# EasyEDA Pro project ProPrj_STM32H723.epro, schematic Schematic1

## Sheets
1 P1: Create Date: 2024-04-22; Page Name: P1; Project Name: STM32H723; Schematic Name: Schematic1; Update Date: 2024-05-16; Company: 嘉立创EDA; Page Size: A4; Version: V1.0
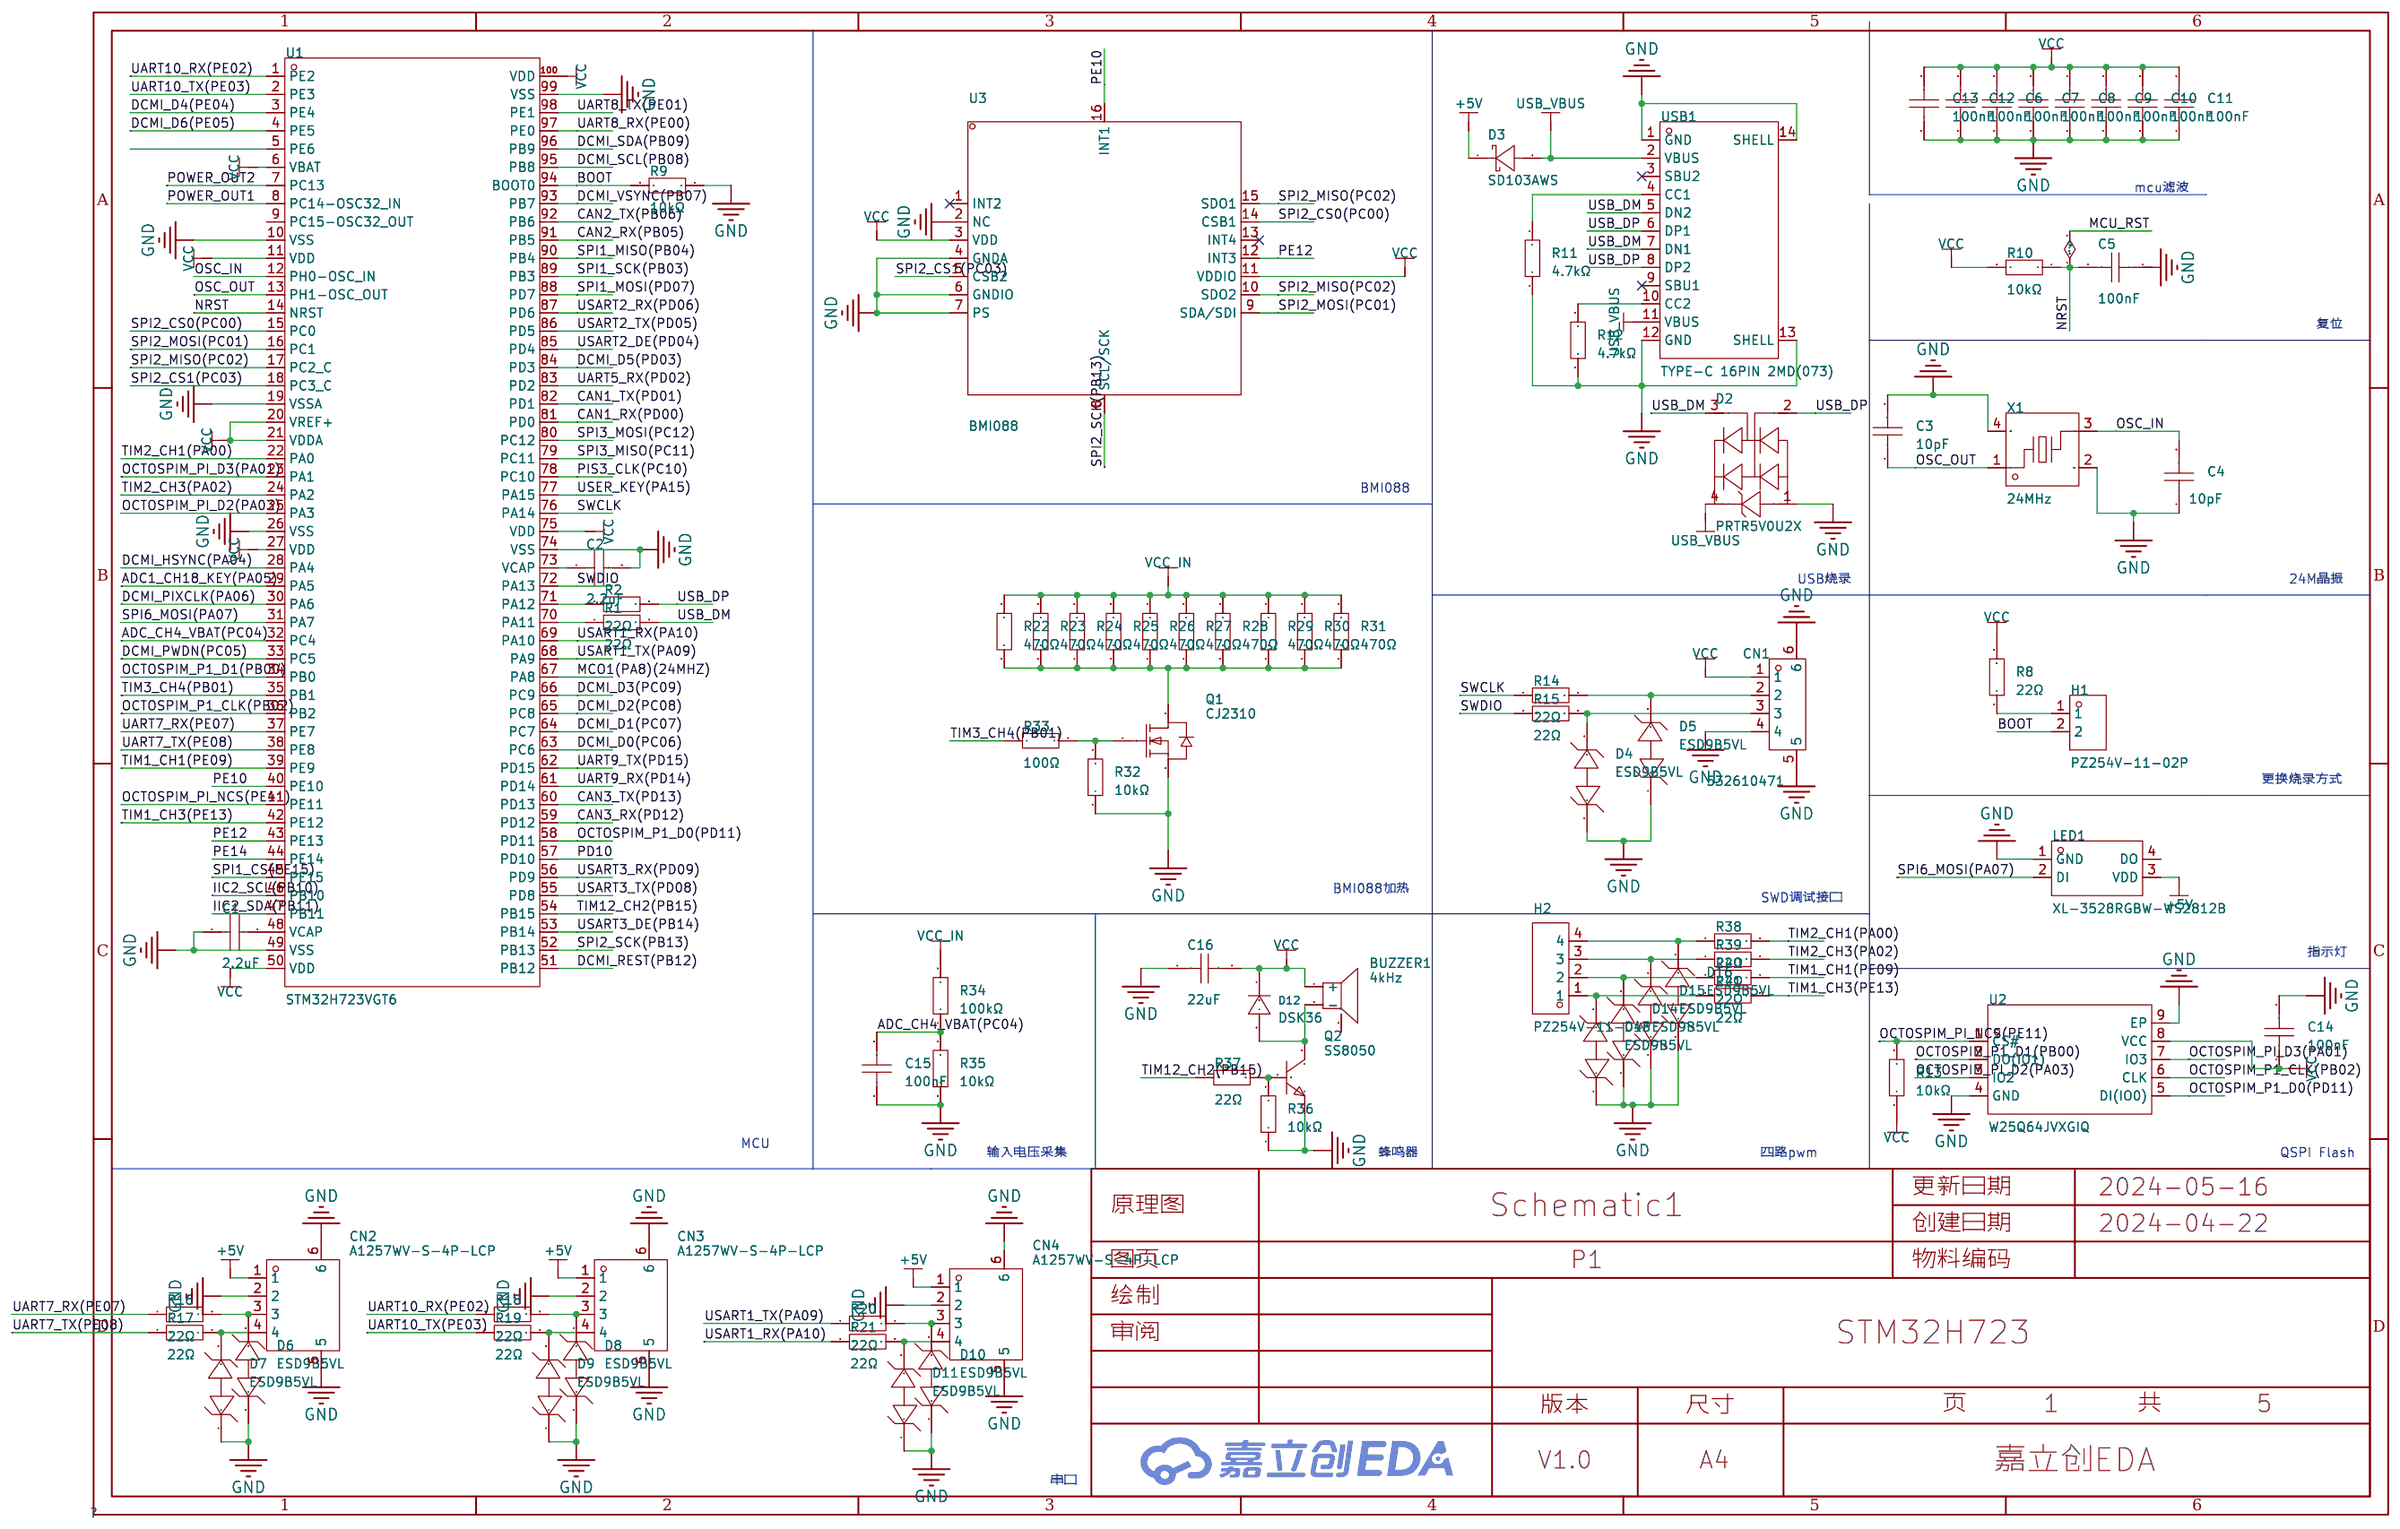
[diagram p0: P1]
2 P2: Create Date: 2024-05-09; Page Name: P2
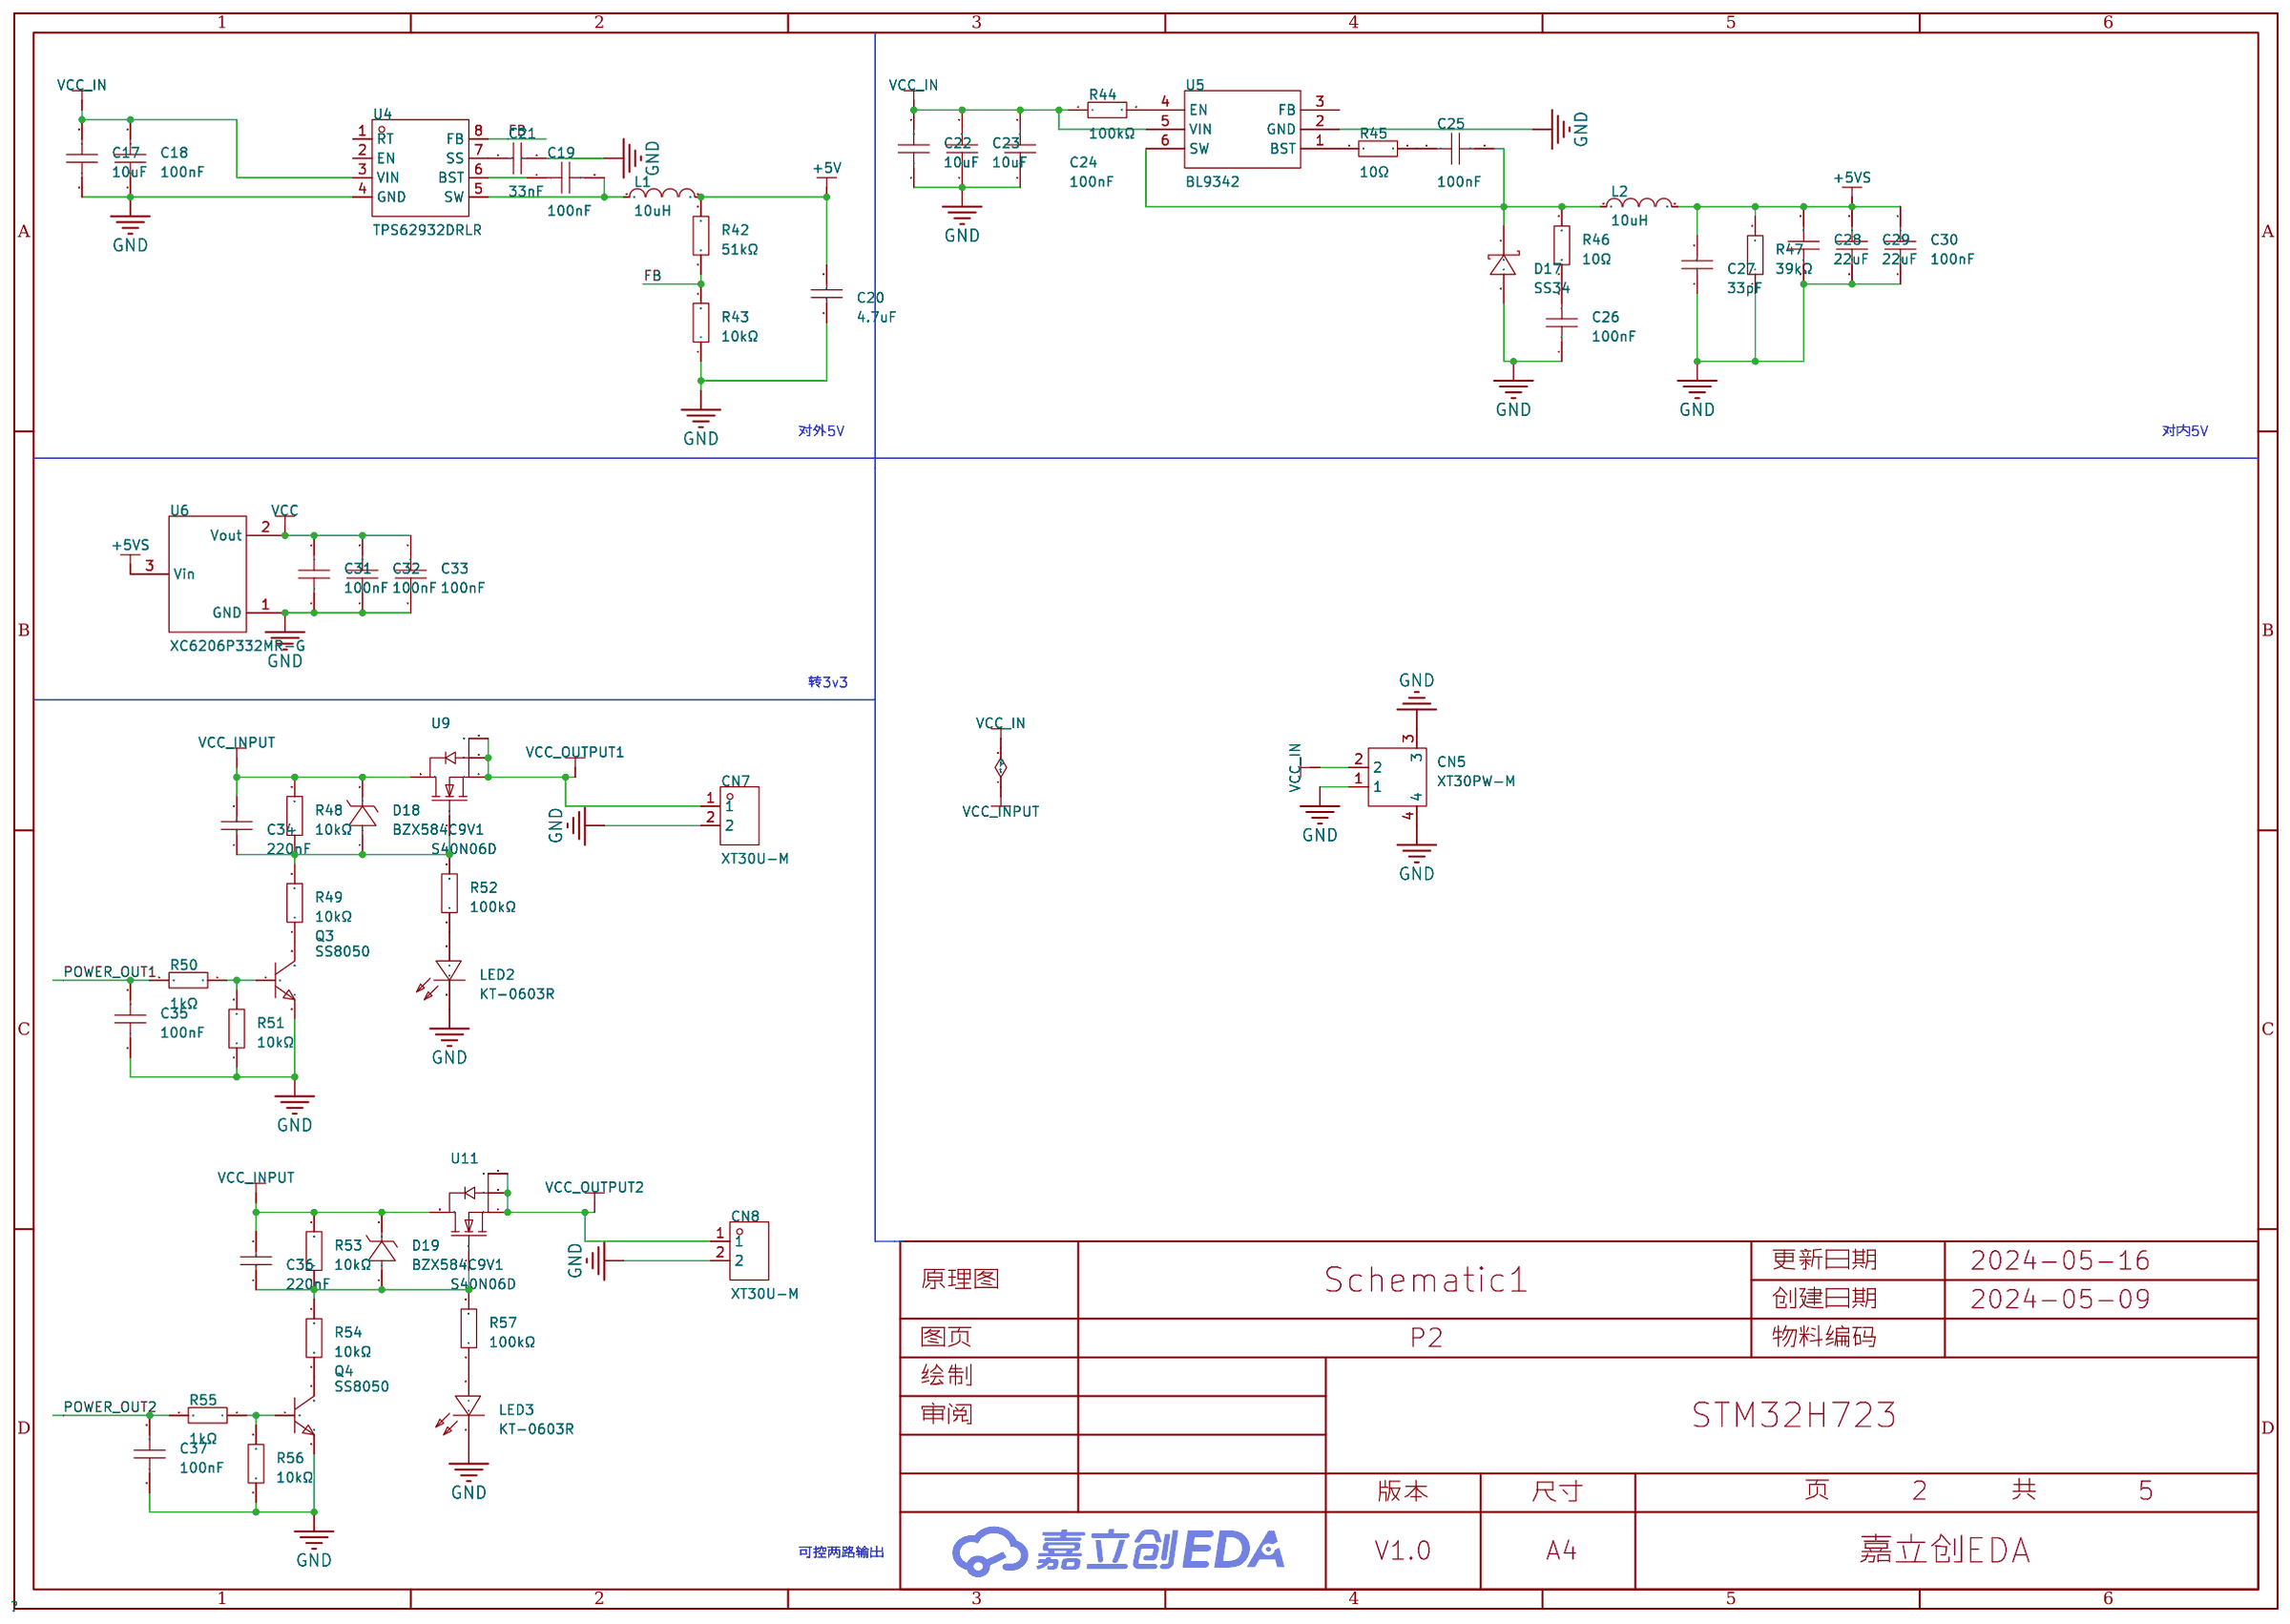
[diagram p1: P2]
3 P3: Create Date: 2024-05-09; Page Name: P3
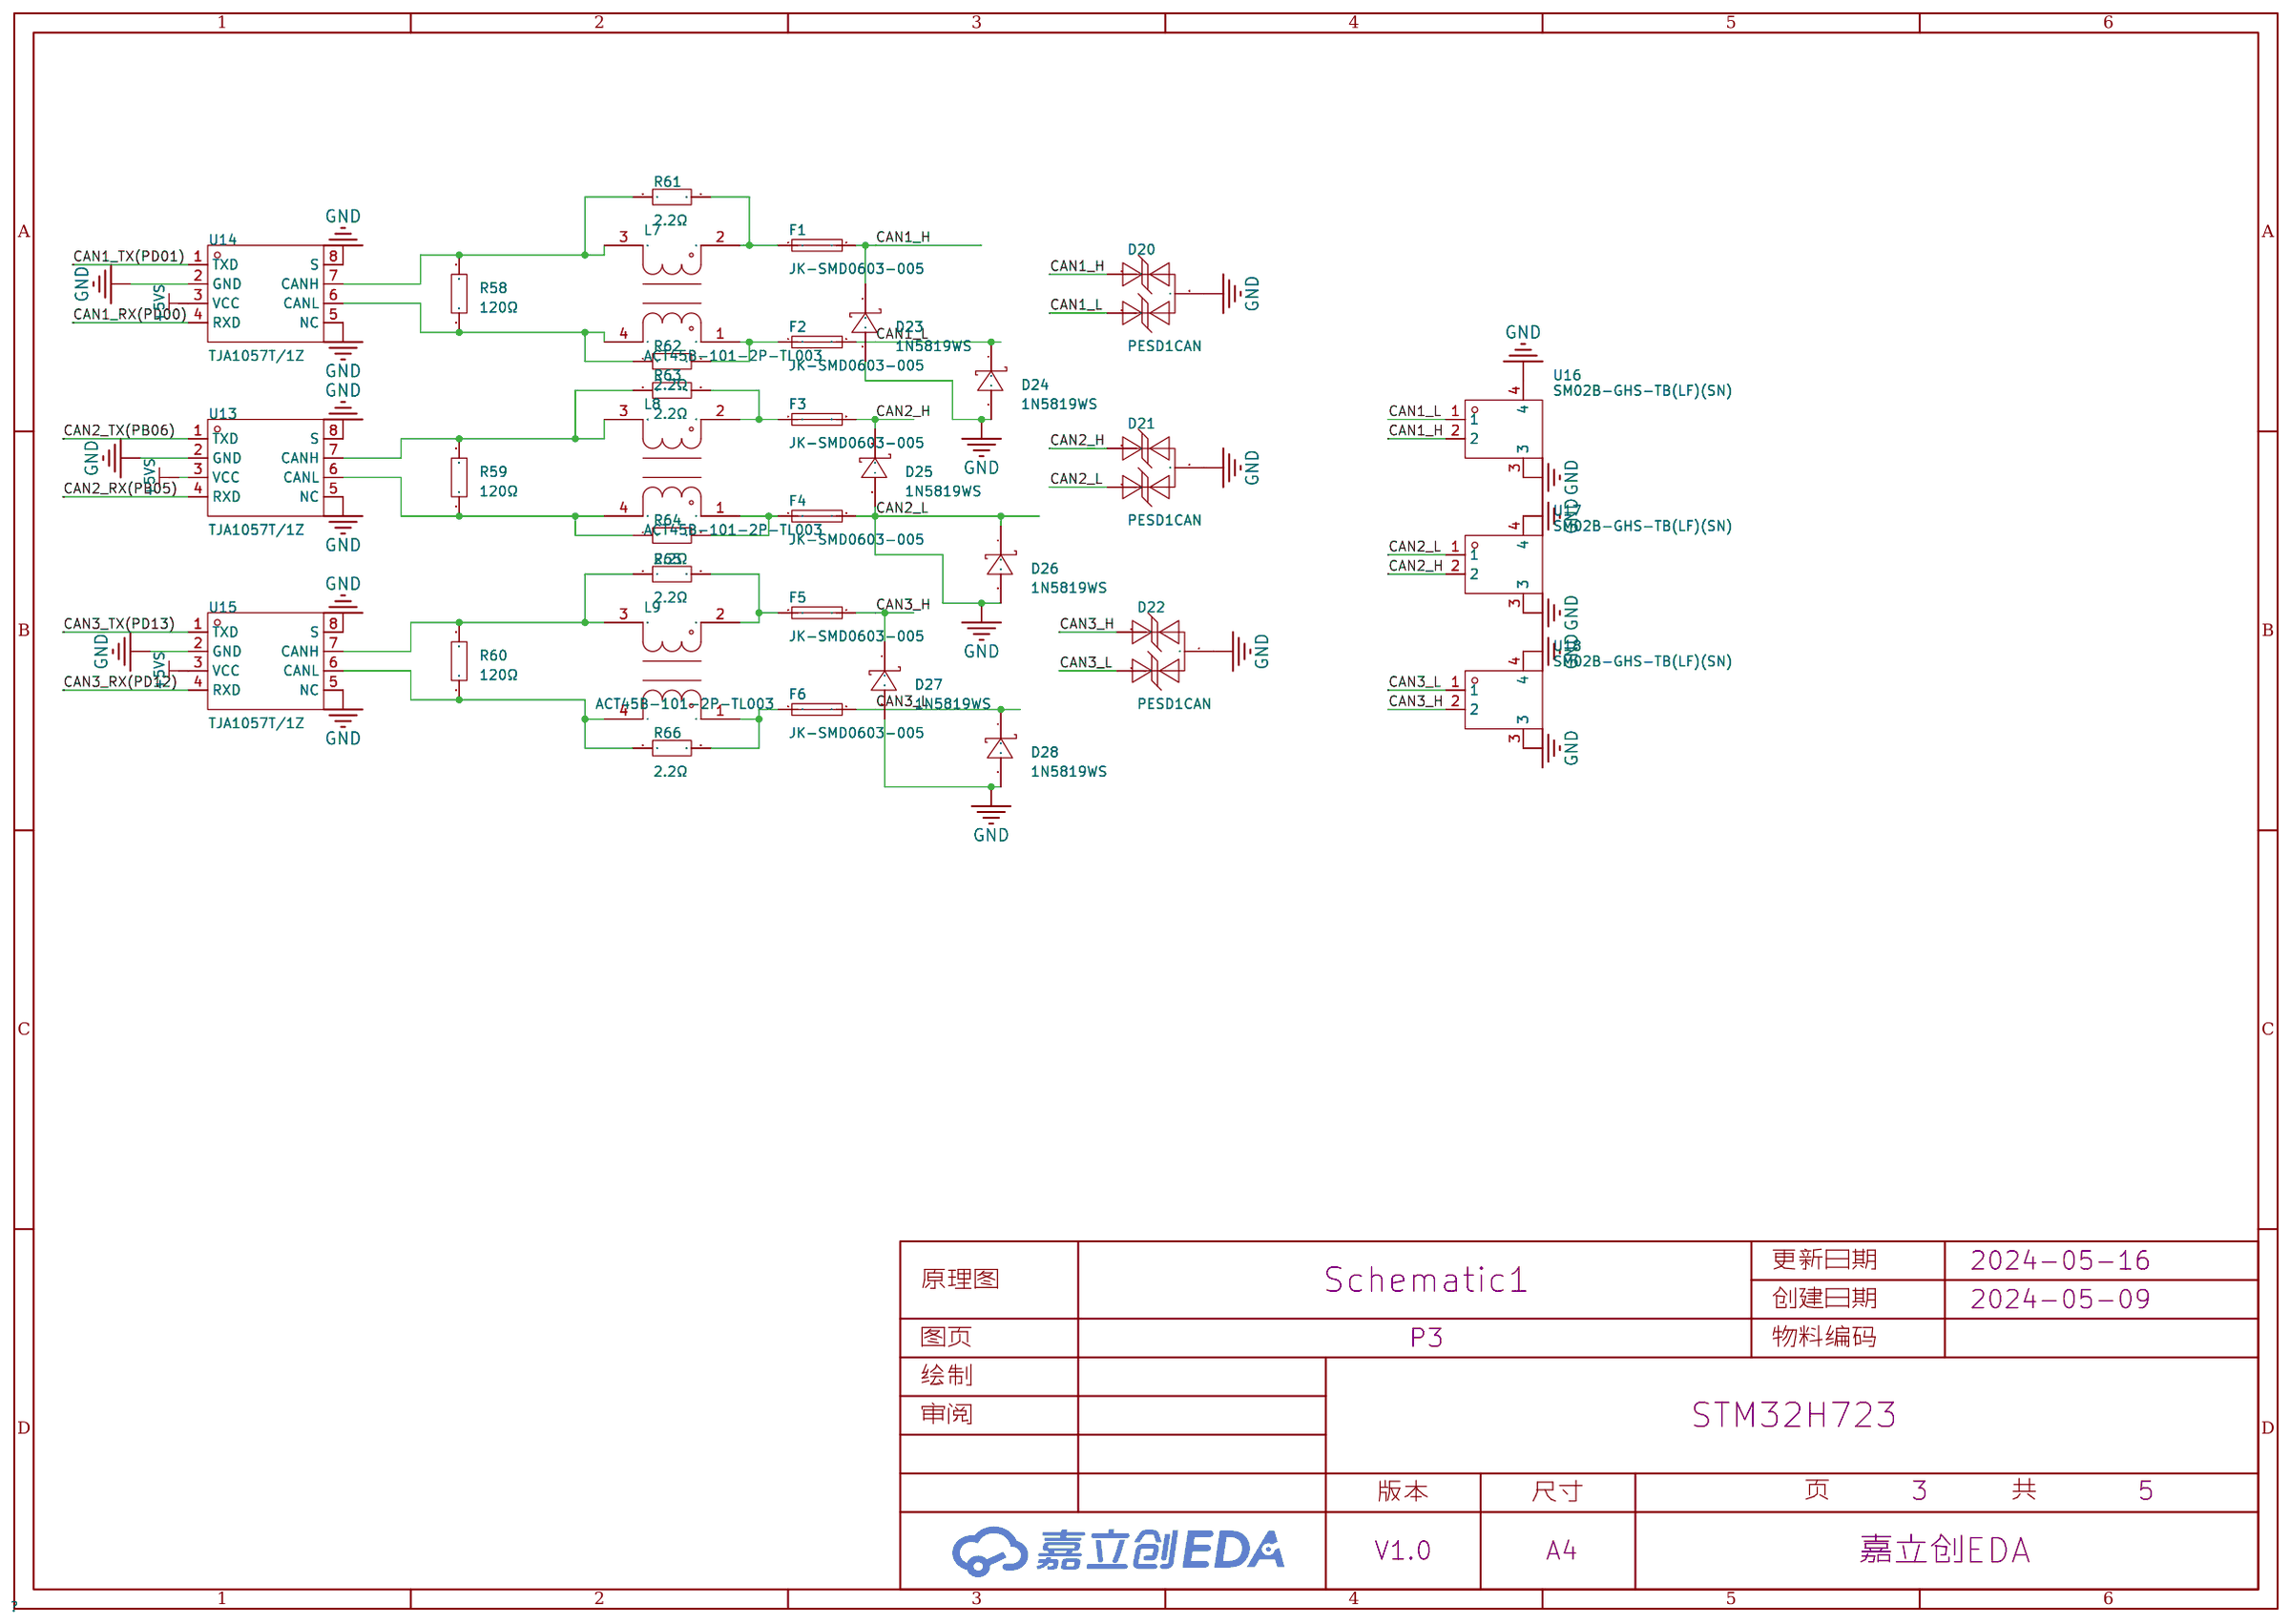
[diagram p2: P3]
4 P4: Create Date: 2024-05-12; Page Name: P4; Update Date: 2024-05-12
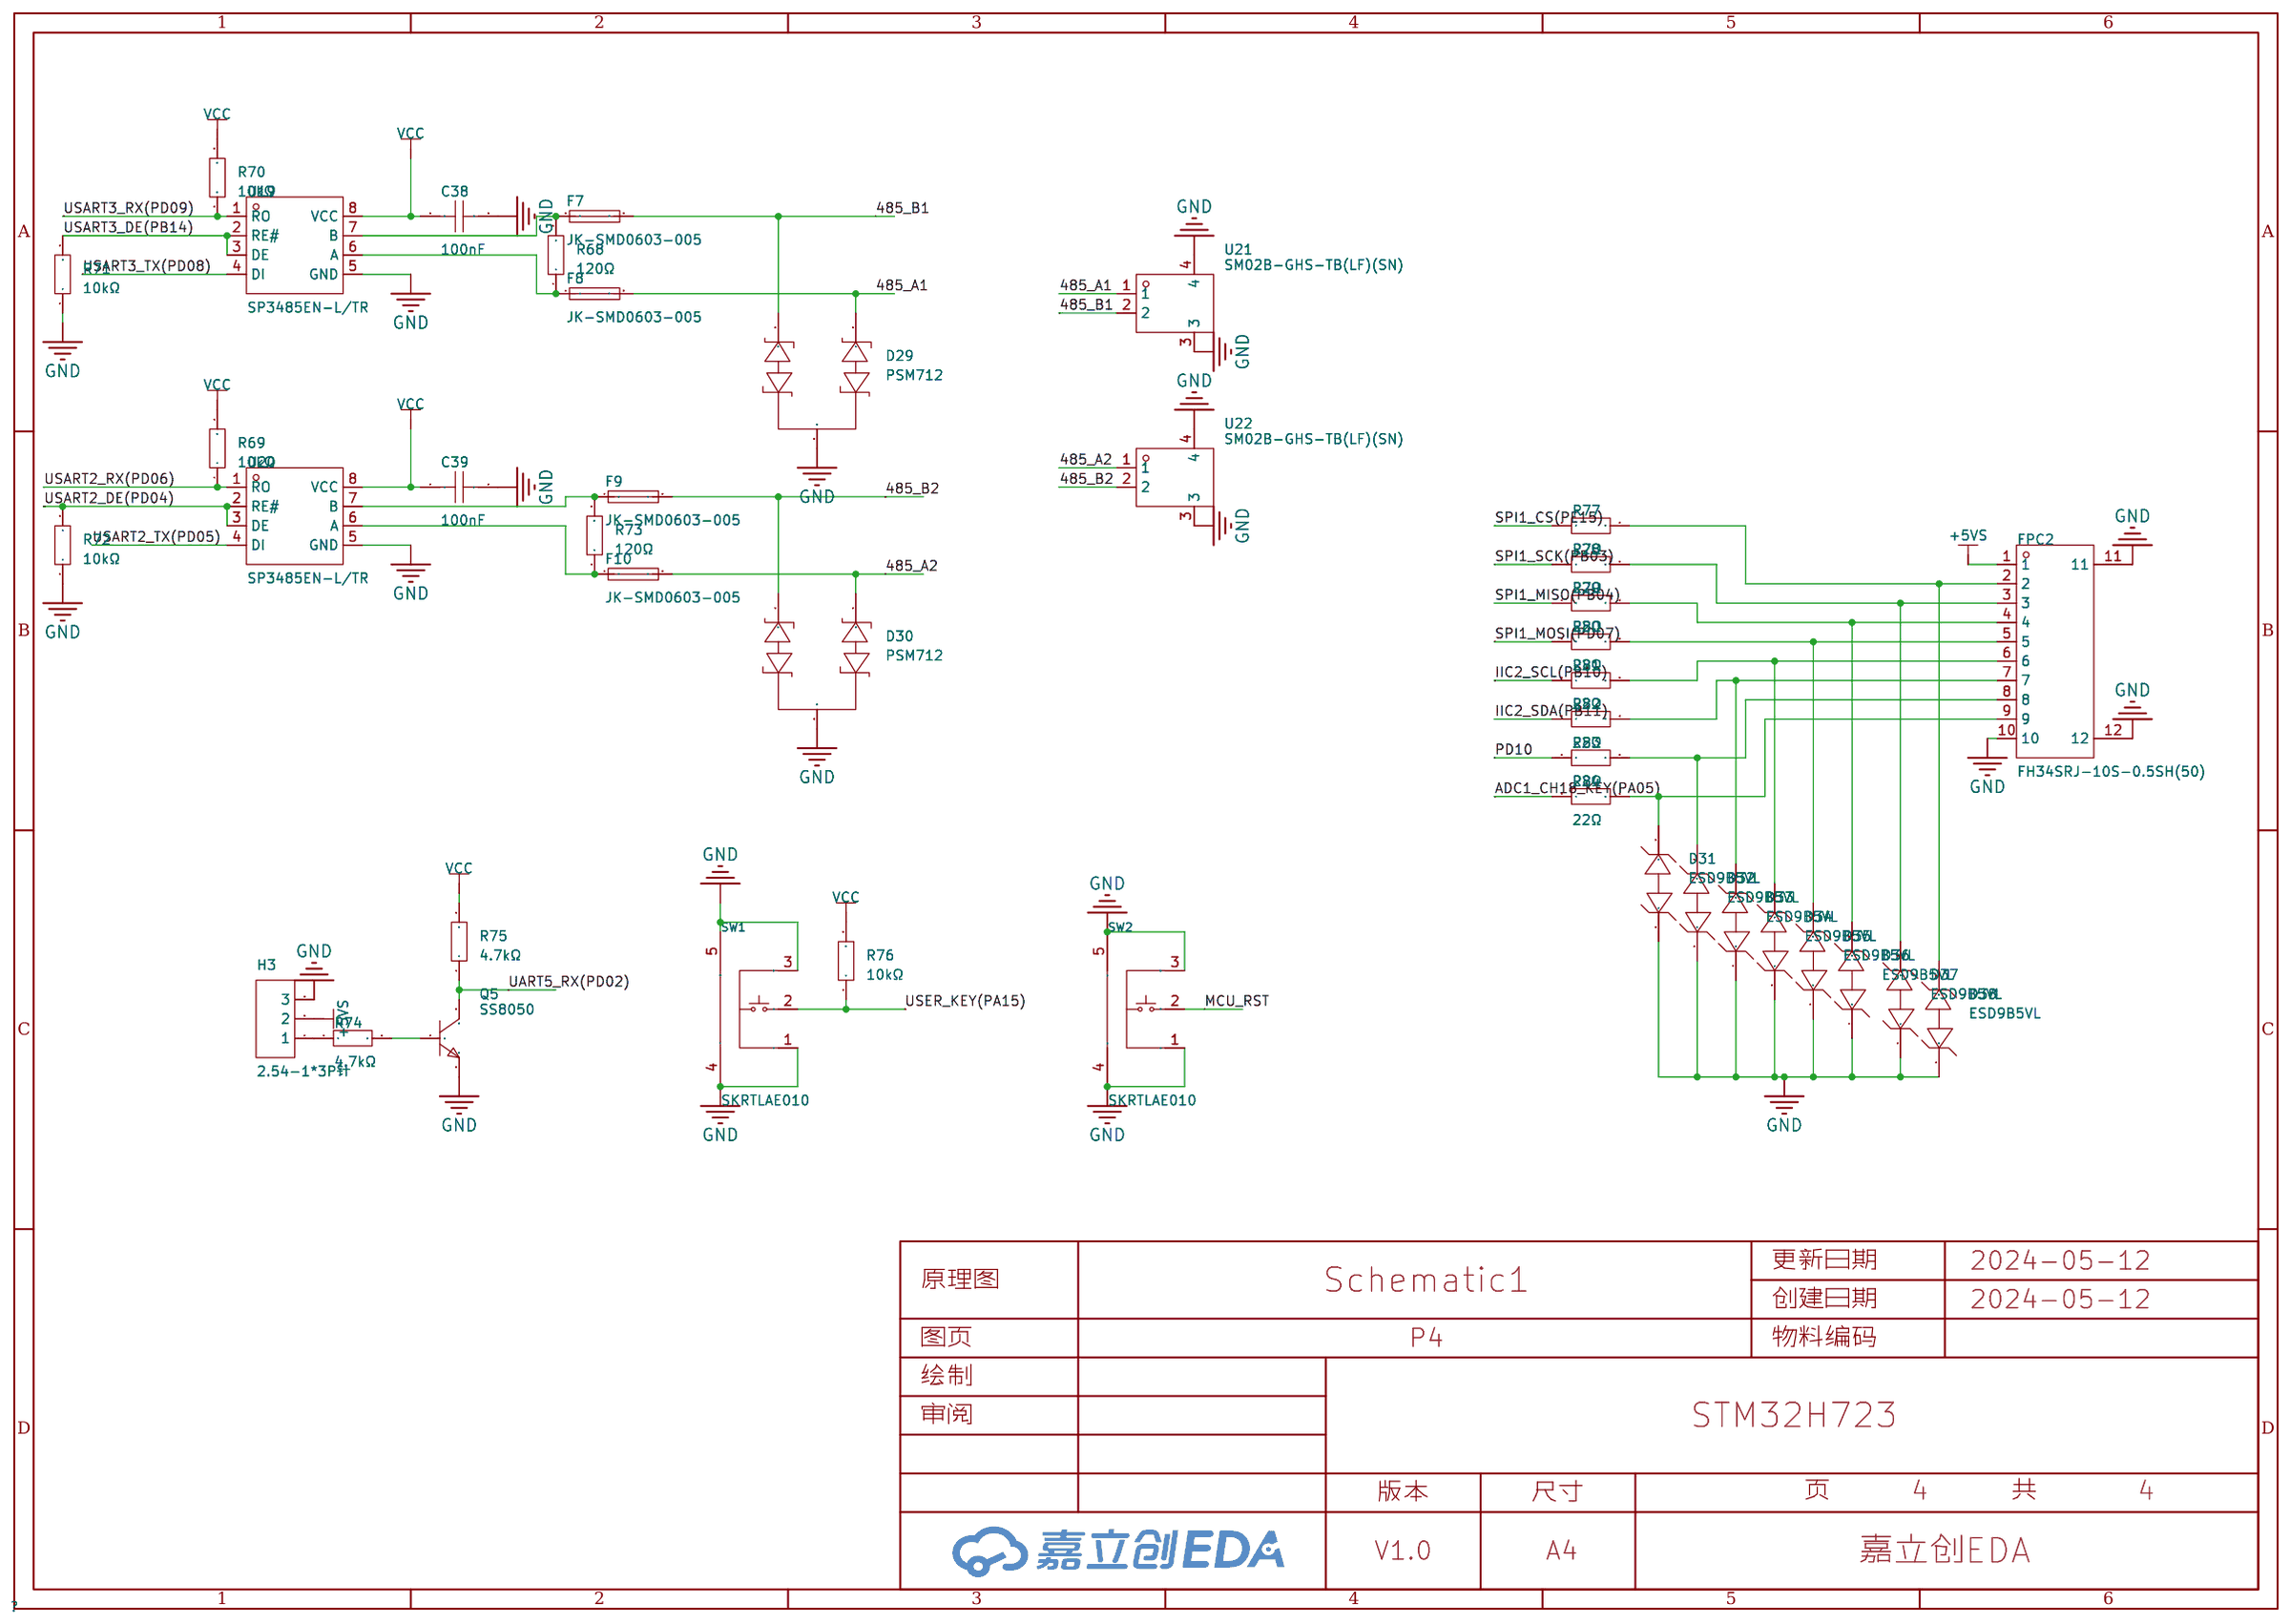
[diagram p3: P4]
5 P5: Create Date: 2024-05-12; Page Name: P5
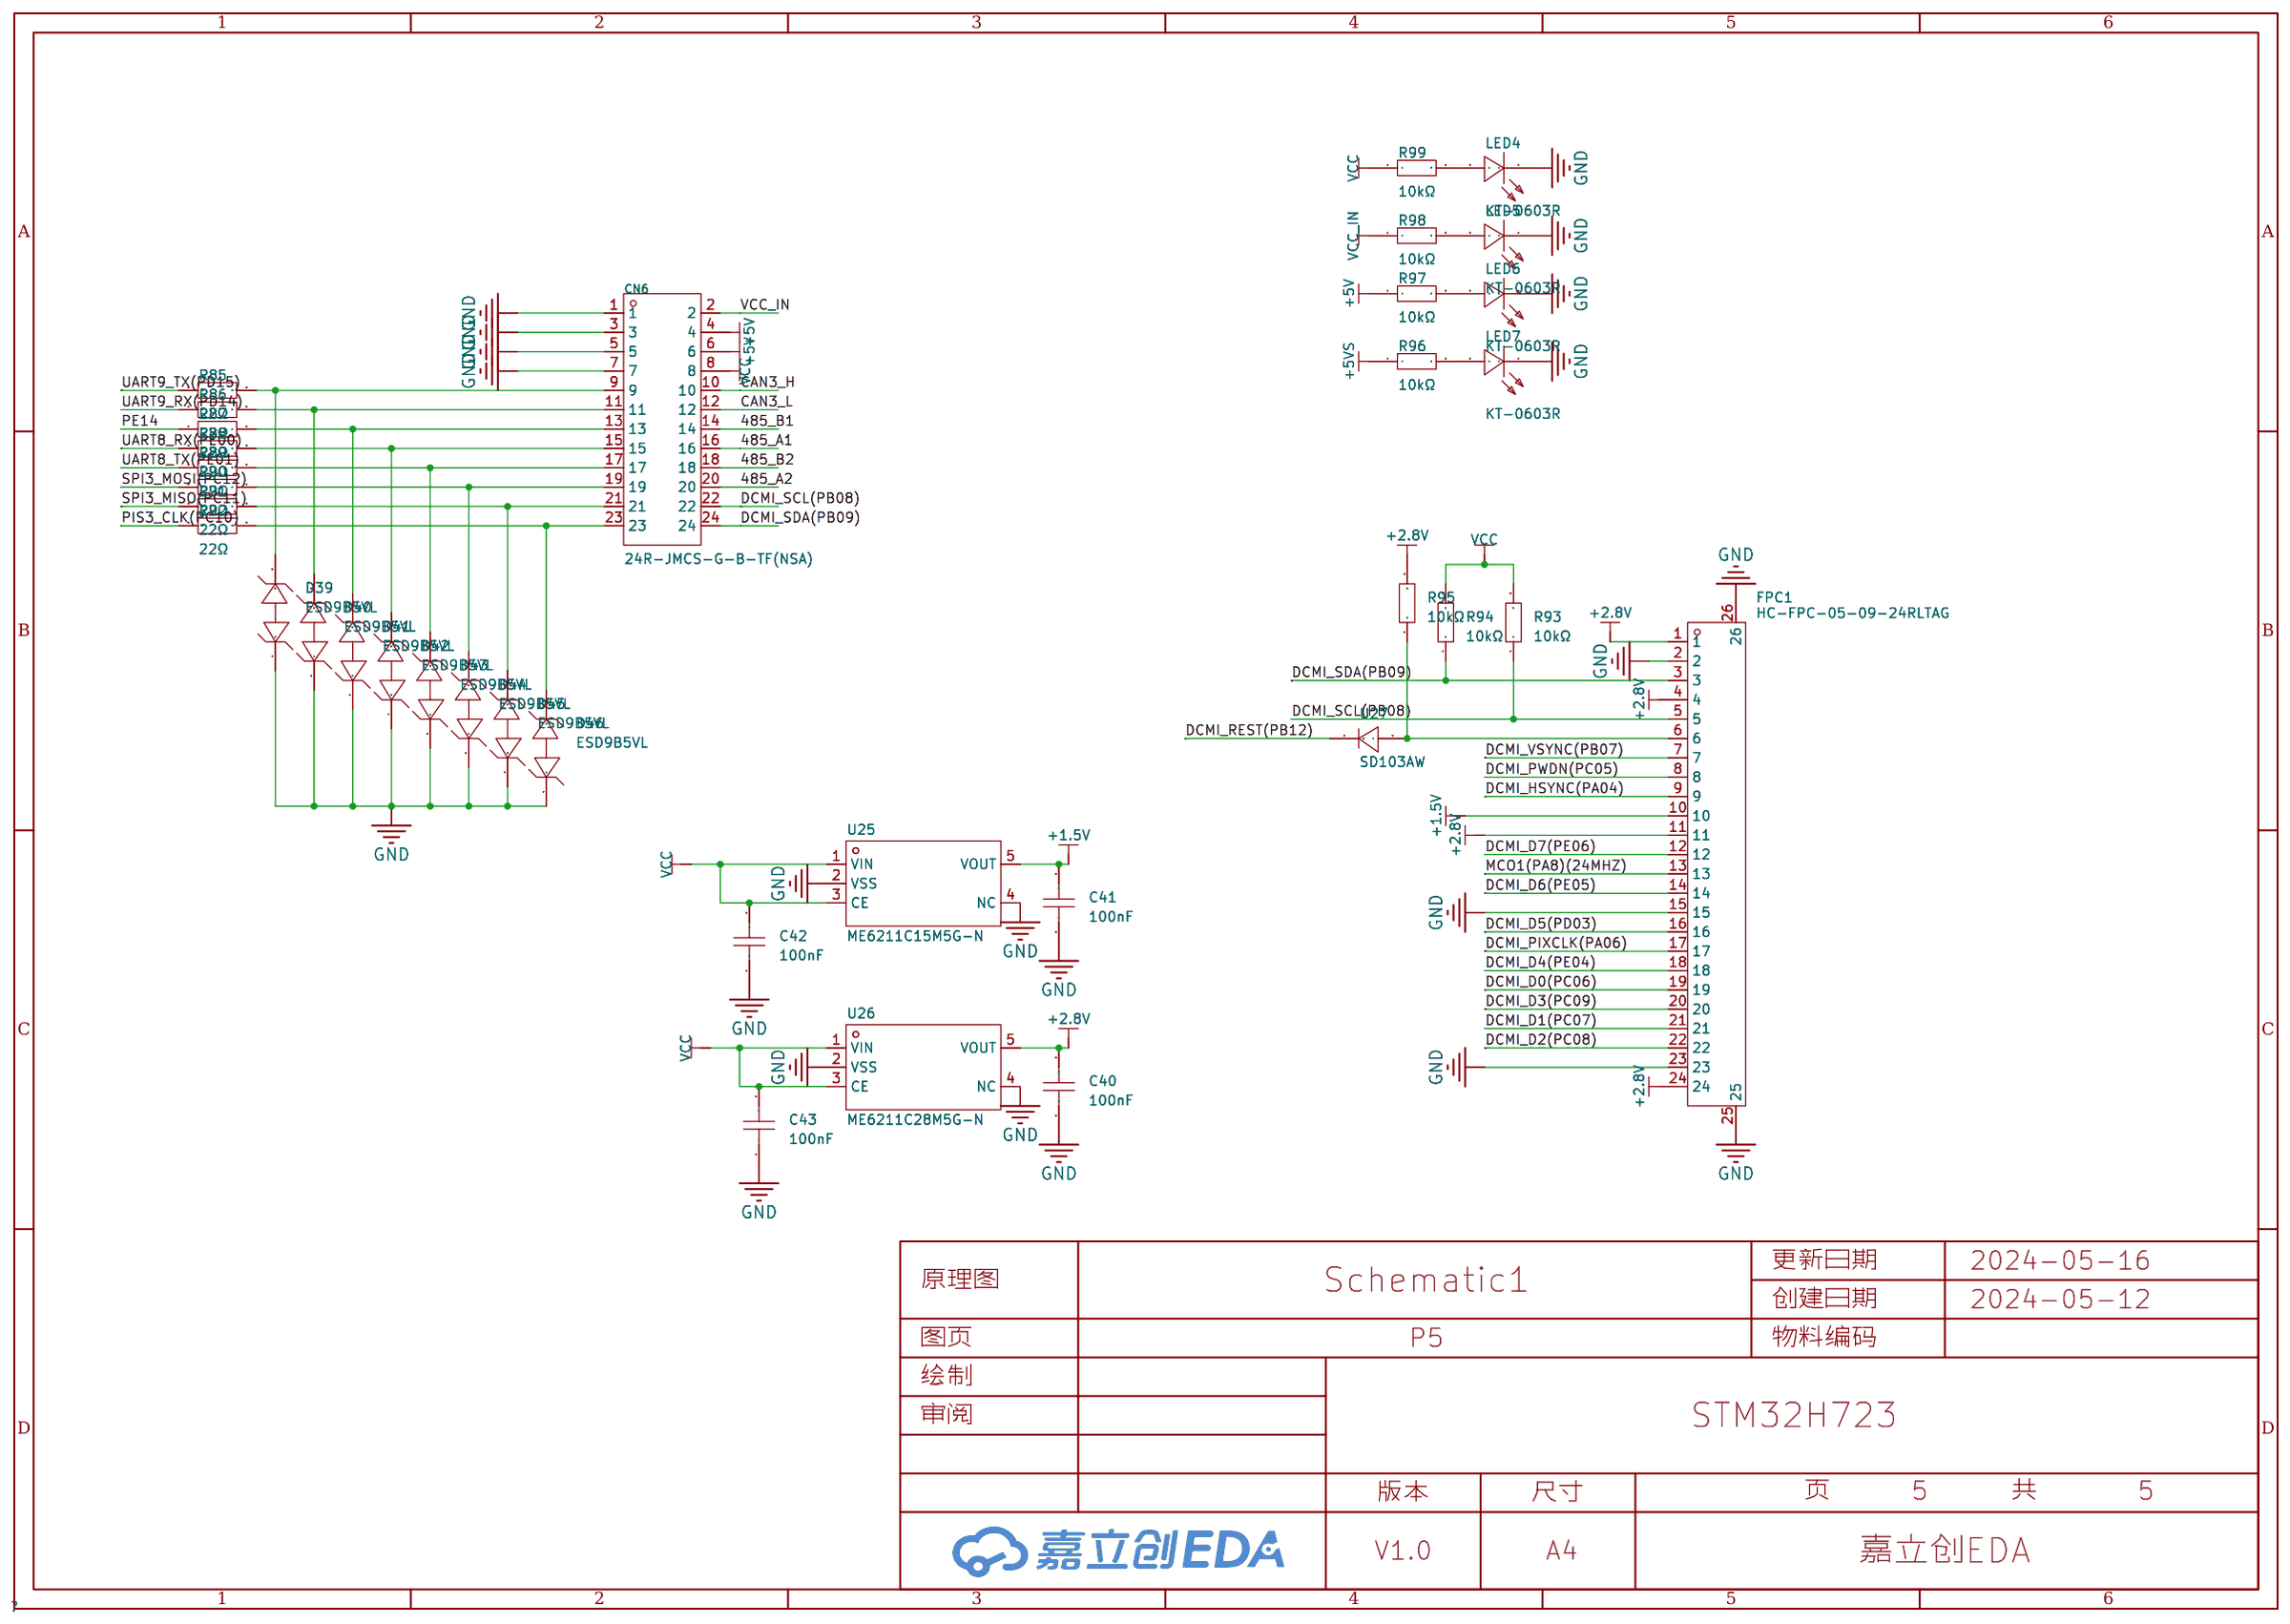
[diagram p4: P5]

## Parts
sheet P1
BUZZER1  4kHz  [BUZ-SMD_L5.0-W5.5-P4.60]
C1  2.2uF  [C0402]
C2  2.2uF  [C0402]
C3  10pF  [C0402]
C4  10pF  [C0402]
C5  100nF  [C0402]
C6  100nF  [C0402]
C7  100nF  [C0402]
C8  100nF  [C0402]
C9  100nF  [C0402]
C10  100nF  [C0402]
C11  100nF  [C0402]
C12  100nF  [C0402]
C13  100nF  [C0402]
C14  100nF  [C0402]
C15  100nF  [C0402]
C16  22uF  [C0603]
CN1  532610471  [CONN-SMD_4P-P1.25_53261-0471]
CN2  A1257WV-S-4P-LCP  [CONN-SMD_A1257WV-S-4P]
CN3  A1257WV-S-4P-LCP  [CONN-SMD_A1257WV-S-4P]
CN4  A1257WV-S-4P-LCP  [CONN-SMD_A1257WV-S-4P]
D2  PRTR5V0U2X  [SOT-143-4_L2.9-W1.3-P1.92-LS2.4-BL]
D3  SD103AWS  [SOD-323_L1.7-W1.3-LS2.5-RD]
D4  ESD9B5VL  [DFN1006-2L-BI]
D5  ESD9B5VL  [DFN1006-2L-BI]
D6  ESD9B5VL  [DFN1006-2L-BI]
D7  ESD9B5VL  [DFN1006-2L-BI]
D8  ESD9B5VL  [DFN1006-2L-BI]
D9  ESD9B5VL  [DFN1006-2L-BI]
D10  ESD9B5VL  [DFN1006-2L-BI]
D11  ESD9B5VL  [DFN1006-2L-BI]
D12  DSK36  [SOD-123FL_L2.7-W1.8-LS3.8-RD]
D13  ESD9B5VL  [DFN1006-2L-BI]
D14  ESD9B5VL  [DFN1006-2L-BI]
D15  ESD9B5VL  [DFN1006-2L-BI]
D16  ESD9B5VL  [DFN1006-2L-BI]
H1  PZ254V-11-02P  [HDR-TH_2P-P2.54-V-M]
H2  PZ254V-11-04P  [HDR-TH_4P-P2.54-V-M]
LED1  XL-3528RGBW-WS2812B  [LED-SMD_4P-L3.5-W2.8-BR-1]
Q1  CJ2310  [SOT-23-3_L2.9-W1.6-P1.90-LS2.8-BR]
Q2  SS8050  [SOT-23-3_L2.9-W1.3-P1.90-LS2.4-BR]
R1  22Ω  [R0603]
R2  22Ω  [R0603]
R8  22Ω  [R0402]
R9  10kΩ  [R0402]
R10  10kΩ  [R0402]
R11  4.7kΩ  [R0402]
R12  4.7kΩ  [R0402]
R13  10kΩ  [R0402]
R14  22Ω  [R0402]
R15  22Ω  [R0402]
R16  22Ω  [R0402]
R17  22Ω  [R0402]
R18  22Ω  [R0402]
R19  22Ω  [R0402]
R20  22Ω  [R0402]
R21  22Ω  [R0402]
R22  470Ω  [R0402]
R23  470Ω  [R0402]
R24  470Ω  [R0402]
R25  470Ω  [R0402]
R26  470Ω  [R0402]
R27  470Ω  [R0402]
R28  470Ω  [R0402]
R29  470Ω  [R0402]
R30  470Ω  [R0402]
R31  470Ω  [R0402]
R32  10kΩ  [R0402]
R33  100Ω  [R0402]
R34  100kΩ  [R0402]
R35  10kΩ  [R0402]
R36  10kΩ  [R0402]
R37  22Ω  [R0402]
R38  22Ω  [R0402]
R39  22Ω  [R0402]
R40  22Ω  [R0402]
R41  22Ω  [R0402]
U1  STM32H723VGT6  [LQFP-100_L14.0-W14.0-P0.50-LS16.0-BL]
U2  W25Q64JVXGIQ  [XSON-8_L4.0-W4.0-P0.80-TL-EP]
U3  BMI088  [LGA-16_L4.5-W3.0-P0.50-BL]
USB1  TYPE-C 16PIN 2MD(073)  [USB-C-SMD_TYPE-C-6PIN-2MD-073]
X1  24MHz  [CRYSTAL-SMD_4P-L2.0-W1.6-BL-A]
sheet P2
C17  10uF  [C0805]
C18  100nF  [C0603]
C19  100nF  [C0603]
C20  4.7uF  [C0603]
C21  33nF  [C0603]
C22  10uF  [C0805]
C23  10uF  [C0805]
C24  100nF  [C0603]
C25  100nF  [C0402]
C26  100nF  [C0402]
C27  33pF  [C0402]
C28  22uF  [C0603]
C29  22uF  [C0603]
C30  100nF  [C0402]
C31  100nF  [C0402]
C32  100nF  [C0402]
C33  100nF  [C0402]
C34  220nF  [C0805]
C35  100nF  [C0402]
C36  220nF  [C0805]
C37  100nF  [C0402]
CN5  XT30PW-M  [CONN-TH_XT30PW-M]
CN7  XT30U-M  [CONN-TH_XT30U-M]
CN8  XT30U-M  [CONN-TH_XT30U-M]
D17  SS34  [SMA_L4.3-W2.6-LS5.2-RD]
D18  BZX584C9V1  [SOD-523_L1.2-W0.8-LS1.6-FD]
D19  BZX584C9V1  [SOD-523_L1.2-W0.8-LS1.6-FD]
L1  10uH  [IND-SMD_L4.0-W4.0]
L2  10uH  [IND-SMD_L4.0-W4.0]
LED2  KT-0603R  [LED0603-RD]
LED3  KT-0603R  [LED0603-RD]
Q3  SS8050  [SOT-23-3_L2.9-W1.3-P1.90-LS2.4-BR]
Q4  SS8050  [SOT-23-3_L2.9-W1.3-P1.90-LS2.4-BR]
R42  51kΩ  [R0402]
R43  10kΩ  [R0402]
R44  100kΩ  [R0402]
R45  10Ω  [R0402]
R46  10Ω  [R0402]
R47  39kΩ  [R0603]
R48  10kΩ  [R0402]
R49  10kΩ  [R0402]
R50  1kΩ  [R0402]
R51  10kΩ  [R0402]
R52  100kΩ  [R0402]
R53  10kΩ  [R0402]
R54  10kΩ  [R0402]
R55  1kΩ  [R0402]
R56  10kΩ  [R0402]
R57  100kΩ  [R0402]
U4  TPS62932DRLR  [SMD-8_L2.1-W1.2-P0.50-LS1.6-BL]
U5  BL9342  [SOT-23-6_L2.9-W1.6-P0.95-LS2.8-BL]
U6  XC6206P332MR-G  [SOT-23-3_L2.9-W1.6-P1.90-LS2.8-BR]
U9  S40N06D  [WDFN-5_L3.3-W3.3-P0.65-BL]
U11  S40N06D  [WDFN-5_L3.3-W3.3-P0.65-BL]
sheet P3
D20  PESD1CAN  [SOT-23-3_L2.9-W1.6-P1.90-LS2.8-BR]
D21  PESD1CAN  [SOT-23-3_L2.9-W1.6-P1.90-LS2.8-BR]
D22  PESD1CAN  [SOT-23-3_L2.9-W1.6-P1.90-LS2.8-BR]
D23  1N5819WS  [SOD-323_L1.8-W1.3-LS2.5-RD]
D24  1N5819WS  [SOD-323_L1.8-W1.3-LS2.5-RD]
D25  1N5819WS  [SOD-323_L1.8-W1.3-LS2.5-RD]
D26  1N5819WS  [SOD-323_L1.8-W1.3-LS2.5-RD]
D27  1N5819WS  [SOD-323_L1.8-W1.3-LS2.5-RD]
D28  1N5819WS  [SOD-323_L1.8-W1.3-LS2.5-RD]
F1  JK-SMD0603-005  [F0603]
F2  JK-SMD0603-005  [F0603]
F3  JK-SMD0603-005  [F0603]
F4  JK-SMD0603-005  [F0603]
F5  JK-SMD0603-005  [F0603]
F6  JK-SMD0603-005  [F0603]
L7  ACT45B-101-2P-TL003  [FILTER-SMD_4P-L4.5-W3.2-TL_ACT45B]
L8  ACT45B-101-2P-TL003  [FILTER-SMD_4P-L4.5-W3.2-TL_ACT45B]
L9  ACT45B-101-2P-TL003  [FILTER-SMD_4P-L4.5-W3.2-TL_ACT45B]
R58  120Ω  [R0402]
R59  120Ω  [R0402]
R60  120Ω  [R0402]
R61  2.2Ω  [R0603]
R62  2.2Ω  [R0603]
R63  2.2Ω  [R0603]
R64  2.2Ω  [R0603]
R65  2.2Ω  [R0603]
R66  2.2Ω  [R0603]
U13  TJA1057T/1Z  [SOP-8_L5.0-W4.0-P1.27-LS6.0-BL]
U14  TJA1057T/1Z  [SOP-8_L5.0-W4.0-P1.27-LS6.0-BL]
U15  TJA1057T/1Z  [SOP-8_L5.0-W4.0-P1.27-LS6.0-BL]
U16  SM02B-GHS-TB(LF)(SN)  [CONN-SMD_SM02B-GHS-TB-LF-SN]
U17  SM02B-GHS-TB(LF)(SN)  [CONN-SMD_SM02B-GHS-TB-LF-SN]
U18  SM02B-GHS-TB(LF)(SN)  [CONN-SMD_SM02B-GHS-TB-LF-SN]
sheet P4
C38  100nF  [C0402]
C39  100nF  [C0402]
D29  PSM712  [SOT-23_L2.9-W1.3-P1.90-LS2.4-BR]
D30  PSM712  [SOT-23_L2.9-W1.3-P1.90-LS2.4-BR]
D31  ESD9B5VL  [DFN1006-2L-BI]
D32  ESD9B5VL  [DFN1006-2L-BI]
D33  ESD9B5VL  [DFN1006-2L-BI]
D34  ESD9B5VL  [DFN1006-2L-BI]
D35  ESD9B5VL  [DFN1006-2L-BI]
D36  ESD9B5VL  [DFN1006-2L-BI]
D37  ESD9B5VL  [DFN1006-2L-BI]
D38  ESD9B5VL  [DFN1006-2L-BI]
F7  JK-SMD0603-005  [F0603]
F8  JK-SMD0603-005  [F0603]
F9  JK-SMD0603-005  [F0603]
F10  JK-SMD0603-005  [F0603]
FPC2  FH34SRJ-10S-0.5SH(50)  [FFC-SMD_10P-P0.50_FH34SRJ-10S-0.5SH]
H3  2.54-1*3P针  [HDR-TH_3P-P2.54-V-M-1]
Q5  SS8050  [SOT-23-3_L2.9-W1.3-P1.90-LS2.4-BR]
R68  120Ω  [R0402]
R69  10kΩ  [R0402]
R70  10kΩ  [R0402]
R71  10kΩ  [R0402]
R72  10kΩ  [R0402]
R73  120Ω  [R0402]
R74  4.7kΩ  [R0402]
R75  4.7kΩ  [R0402]
R76  10kΩ  [R0402]
R77  22Ω  [R0402]
R78  22Ω  [R0402]
R79  22Ω  [R0402]
R80  22Ω  [R0402]
R81  22Ω  [R0402]
R82  22Ω  [R0402]
R83  22Ω  [R0402]
R84  22Ω  [R0402]
SW1  SKRTLAE010  [KEY-SMD_SKRTLAE010]
SW2  SKRTLAE010  [KEY-SMD_SKRTLAE010]
U19  SP3485EN-L/TR  [SOIC-8_L5.0-W4.0-P1.27-LS6.0-BL]
U20  SP3485EN-L/TR  [SOIC-8_L5.0-W4.0-P1.27-LS6.0-BL]
U21  SM02B-GHS-TB(LF)(SN)  [CONN-SMD_SM02B-GHS-TB-LF-SN]
U22  SM02B-GHS-TB(LF)(SN)  [CONN-SMD_SM02B-GHS-TB-LF-SN]
sheet P5
C40  100nF  [C0402]
C41  100nF  [C0402]
C42  100nF  [C0402]
C43  100nF  [C0402]
CN6  24R-JMCS-G-B-TF(NSA)  [CONN-SMD_24P-P0.50_JST_24R-JMCS-G-B-TF]
D39  ESD9B5VL  [DFN1006-2L-BI]
D40  ESD9B5VL  [DFN1006-2L-BI]
D41  ESD9B5VL  [DFN1006-2L-BI]
D42  ESD9B5VL  [DFN1006-2L-BI]
D43  ESD9B5VL  [DFN1006-2L-BI]
D44  ESD9B5VL  [DFN1006-2L-BI]
D45  ESD9B5VL  [DFN1006-2L-BI]
D46  ESD9B5VL  [DFN1006-2L-BI]
FPC1  HC-FPC-05-09-24RLTAG  [FPC-SMD_24P-P0.50_HC-FPC-05-09-24RLTAG]
LED4  KT-0603R  [LED0603-RD]
LED5  KT-0603R  [LED0603-RD]
LED6  KT-0603R  [LED0603-RD]
LED7  KT-0603R  [LED0603-RD]
R85  22Ω  [R0402]
R86  22Ω  [R0402]
R87  22Ω  [R0402]
R88  22Ω  [R0402]
R89  22Ω  [R0402]
R90  22Ω  [R0402]
R91  22Ω  [R0402]
R92  22Ω  [R0402]
R93  10kΩ  [R0402]
R94  10kΩ  [R0402]
R95  10kΩ  [R0402]
R96  10kΩ  [R0402]
R97  10kΩ  [R0402]
R98  10kΩ  [R0402]
R99  10kΩ  [R0402]
U25  ME6211C15M5G-N  [SOT-23-5_L3.0-W1.7-P0.95-LS2.8-BR]
U26  ME6211C28M5G-N  [SOT-23-5_L3.0-W1.7-P0.95-LS2.8-BR]
U27  SD103AW  [SOD-123_L2.8-W1.8-LS3.7-RD]

## Library data of the parts
BUZZER1 = MLT-5020: 驱动方式:无源(外部驱动);构造类型:电磁式;频率:4kHz;; Supplier Part: C94598; Manufacturer: 华能; Supplier Footprint: SMD,5x5mm; JLCPCB Part Class: 扩展库; Datasheet: https://atta.szlcsc.com/upload/public/pdf/source/20210811/111454390007D221D7259018FB170E62.pdf; Supplier: LCSC; Oscillator Circuit: 无源(外部驱动); Technology Type: 电磁式; Length: 5.2mm; Width: 5.2mm; Height: 2.5mm
C1 C2 = CL05A225MQ5NSNC: 容值:2.2uF;精度:±20%;额定电压:6.3V;材质(温度系数):X5R;; LCSC Part Name: 2.2uF ±20% 6.3V; Supplier Part: C12530; Manufacturer: SAMSUNG(三星); Supplier Footprint: 0402; JLCPCB Part Class: 基础库; Datasheet: https://atta.szlcsc.com/upload/public/pdf/source/20160218/1457707763339.pdf; Supplier: LCSC; Tolerance: ±20%; Voltage Rated: 6.3V; Temperature Coefficient: X5R
C3 C4 = CL05C100JB5NNNC: 容值:10pF;精度:±5%;额定电压:50V;材质(温度系数):C0G;; LCSC Part Name: 10pF ±5% 50V; Supplier Part: C32949; Manufacturer: SAMSUNG(三星); Supplier Footprint: 0402; JLCPCB Part Class: 基础库; Datasheet: https://atta.szlcsc.com/upload/public/pdf/source/20160218/1457707763339.pdf; Supplier: LCSC; Tolerance: ±5%; Voltage Rated: 50V; Temperature Coefficient: C0G
C5-C15 C25 C26 C30-C33 C35 C37-C43 = CL05B104KB54PNC: 容值:100nF;精度:±10%;额定电压:50V;材质(温度系数):X7R;; LCSC Part Name: 100nF ±10% 50V; Supplier Part: C307331; Manufacturer: SAMSUNG(三星); Supplier Footprint: 0402; JLCPCB Part Class: 基础库; Datasheet: https://atta.szlcsc.com/upload/public/pdf/source/20160218/1457707763339.pdf; Supplier: LCSC; Tolerance: ±10%; Voltage Rated: 50V; Temperature Coefficient: X7R
C16 C28 C29 = CL10A226MQ8NRNC: 容值:22uF;精度:±20%;额定电压:6.3V;材质(温度系数):X5R;; LCSC Part Name: 22uF ±20% 6.3V; Supplier Part: C59461; Manufacturer: SAMSUNG(三星); Supplier Footprint: 0603; JLCPCB Part Class: 基础库; Datasheet: https://atta.szlcsc.com/upload/public/pdf/source/20160218/1457707763339.pdf; Supplier: LCSC; Tolerance: ±20%; Voltage Rated: 6.3V; Temperature Coefficient: X5R
CN1 = 532610471_C696092: Supplier Part: C696092; Manufacturer: MOLEX; Supplier Footprint: SMD,P=1.25mm; JLCPCB Part Class: 扩展库; Datasheet: https://atta.szlcsc.com/upload/public/pdf/source/20180801/C240848_05185111BCEC053393D7785380F62CFD.pdf; Supplier: LCSC
CN2-CN4 = A1257WV-S-4P-LCP: 插针结构:1x4P;间距:1.25mm;安装方式:-;参考系列:GH;总PIN数:4P;排数:1;每排PIN数:4;行距:-;触头材质:黄铜;; LCSC Part Name: 系列:GH 间距:1.25mm 1x4P; Supplier Part: C225120; Manufacturer: CJT(长江连接器); Supplier Footprint: SMD,P=1.25mm; JLCPCB Part Class: 扩展库; Datasheet: https://atta.szlcsc.com/upload/public/pdf/source/20181008/C272994_C9E89FA8A36D0009CAD30AD8C59C2782.pdf; Supplier: LCSC; Pins Structure: 1x4P; Pitch: 1.25mm; Reference Series: GH; Number of Pins: 4P; Number of Rows: 1; Number of PINs Per Row: 4; Contact Material: 黄铜
D2 = PRTR5V0U2X: Supplier Part: C2827688; Manufacturer: TECH PUBLIC(台舟); Supplier Footprint: SOT-143-4; JLCPCB Part Class: 扩展库; Datasheet: https://atta.szlcsc.com/upload/public/pdf/source/20210810/88897AC68D8E670F0742145AB5FD843C.pdf; Supplier: LCSC; Type: ESD
D3 = SD103AWS_C5345966: 二极管配置:独立式;正向压降(Vf):600mV@200mA;直流反向耐压(Vr):40V;平均整流电流(Io):350mA;; LCSC Part Name: 电压:40V 电流:350mA; Supplier Part: C5345966; Manufacturer: HXY MOSFET(华轩阳电子); Supplier Footprint: SOD-323; JLCPCB Part Class: 扩展库; Datasheet: https://atta.szlcsc.com/upload/public/pdf/source/20230718/EB21839A2CC0920143E136B6DCD4DE0B.pdf; Supplier: LCSC; Diode Configuration: 独立式; Forward Voltage (Vf@If): 600mV@200mA; Reverse Voltage (Vr): 40V; Average Rectified Current (Io): 350mA; Reverse Leakage Current (Ir): 5uA@30V; Peak forward surge current: 2A
D4-D11 D13-D16 D31-D46 = ESD9B5VL_C2827544: Supplier Part: C2827544; Manufacturer: TECH PUBLIC(台舟); Supplier Footprint: DFN1006; JLCPCB Part Class: 扩展库; Datasheet: https://atta.szlcsc.com/upload/public/pdf/source/20210810/052284C51FC53F995F923BBD7E8BF946.pdf; Supplier: LCSC; Type: ESD
D12 = DSK36_C106913: 正向压降(Vf):700mV@3A;直流反向耐压(Vr):60V;平均整流电流(Io):3A;; LCSC Part Name: 电压:60V 电流:3A; Supplier Part: C106913; Manufacturer: MDD; Supplier Footprint: SOD-123FL; JLCPCB Part Class: 扩展库; Datasheet: https://atta.szlcsc.com/upload/public/pdf/source/20230823/59DBCD4B265CD39EE1CF1649DFCCB71C.pdf; Supplier: LCSC; Forward Voltage (Vf@If): 700mV@3A; Reverse Voltage (Vr): 60V; Average Rectified Current (Io): 3A
H1 = PZ254V-11-02P: 插针结构:1x2P;间距:2.54mm;行距:-;圆针/方针:方针;安装类型:直插;排数:单排;总PIN位数:2P;额定电流:-;额定电压:-;配合针长度:6mm;塑高:2.5mm;端接针长度:3mm;触头材质:黄铜;触头镀层:-;工作温度范围:-40℃~+105℃;颜色:黑色;; LCSC Part Name: 间距:2.54mm 1x2P 直插 方针; Supplier Part: C492401; Manufacturer: XFCN(兴飞); Supplier Footprint: 插件,P=2.54mm; JLCPCB Part Class: 扩展库; Datasheet: https://atta.szlcsc.com/upload/public/pdf/source/20200309/C492401_A812433581A9B211A7FFA413ADDFF0E5.pdf; Supplier: LCSC; Pin Structure: 1x2P; Pitch: 2.54mm; Circluar Pins/Square Pins: 方针; Mounting Type: 直插; Number of Rows: 单排; Number of Pins: 2P; Length of Mating Pin: 6mm; Insulation Height: 2.5mm; Length of End Connection Pin: 3mm; Contact Material: 黄铜; Operating Temperature Range: -40℃~+105℃; Color: 黑色
H2 = PZ254V-11-04P: 插针结构:1x4P;间距:2.54mm;行距:-;圆针/方针:方针;安装类型:直插;排数:单排;总PIN位数:4P;额定电流:3A;额定电压:250V;配合针长度:6mm;塑高:2.5mm;端接针长度:3mm;触头材质:-;工作温度范围:-40℃~+105℃;颜色:黑色;; LCSC Part Name: 间距:2.54mm 1x4P 直插 方针; Supplier Part: C2691448; Manufacturer: XFCN(兴飞); Supplier Footprint: 插件,P=2.54mm; JLCPCB Part Class: 扩展库; Datasheet: https://atta.szlcsc.com/upload/public/pdf/source/20200309/C492403_F9F19131791D08044AD4F84F8E751A34.pdf; Supplier: LCSC; Pin Structure: 1x4P; Pitch: 2.54mm; Circluar Pins/Square Pins: 方针; Mounting Type: 直插; Number of Rows: 单排; Number of Pins: 4P; Current Rating (Max): 3A; Voltage Rating (Max): 250V; Length of Mating Pin: 6mm; Insulation Height: 2.5mm; Length of End Connection Pin: 3mm; Operating Temperature Range: -40℃~+105℃; Color: 黑色
LED1 = XL-3528RGBW-WS2812B: 3528 七彩幻彩雾状 ws2812B 内置驱动IC; Supplier Part: C2890364; Manufacturer: XINGLIGHT(成兴光); Supplier Footprint: SMD3528-4P; JLCPCB Part Class: 扩展库; Datasheet: https://atta.szlcsc.com/upload/public/pdf/source/20240218/041E1E0D0024617DFFF124D9C311BB4D.pdf; Supplier: LCSC
Q1 = CJ2310: 类型:1个N沟道;漏源电压(Vdss):60V;连续漏极电流(Id):3A;功率(Pd):350mW;导通电阻(RDS(on)@Vgs,Id):105mΩ@10V,3A;阈值电压(Vgs(th)@Id):2V;; LCSC Part Name: 1个N沟道 耐压:60V 电流:3A; Supplier Part: C75882; Manufacturer: CJ(江苏长电/长晶); Supplier Footprint: SOT-23; JLCPCB Part Class: 扩展库; Datasheet: https://atta.szlcsc.com/upload/public/pdf/source/20160713/1468379856997.pdf; Supplier: LCSC; Type: 1个N沟道; Drain Source Voltage (Vdss): 60V; Continuous Drain Current (Id): 3A; Power Dissipation (Pd): 350mW; Drain Source On Resistance (RDS(on)@Vgs,Id): 105mΩ@10V,3A; Gate Threshold Voltage (Vgs(th)@Id): 2V; Total Gate Charge (Qg@Vgs): 6nC; Input Capacitance (Ciss@Vds): 274pF; Reverse Transfer Capacitance (Crss@Vds): 19.5pF
Q2-Q5 = SS8050_C2150: 晶体管类型:NPN;集电极电流(Ic):1.5A;集射极击穿电压(Vceo):25V;功率(Pd):300mW;直流电流增益(hFE@Ic,Vce):200@100mA,1V;; LCSC Part Name: SS8050(RANGE:200-350) hfe=200~350; Supplier Part: C2150; Manufacturer: CJ(江苏长电/长晶); Supplier Footprint: SOT-23; JLCPCB Part Class: 基础库; Datasheet: https://atta.szlcsc.com/upload/public/pdf/source/20230322/AEE86F4B043774EFF80CAEA14A37D9E9.pdf; Supplier: LCSC; Transistor Type: NPN; Collector Current (Ic): 1.5A; Collector-Emitter Breakdown Voltage (Vceo): 25V; Power Dissipation (Pd): 300mW; DC Current Gain (hFE@Ic,Vce): 200@100mA,1V; Transition Frequency (fT): 100MHz; Collector Cut-Off Current (Icbo): 100nA; Collector-Emitter Saturation Voltage (VCE(sat)@Ic,Ib): 500mV@800mA,80mA
R1 R2 = 0603WAF220JT5E: 电阻类型:厚膜电阻;阻值:22Ω;精度:±1%;功率:100mW;最大工作电压:75V;温度系数:±100ppm/℃;; LCSC Part Name: 22Ω ±1% 100mW 厚膜电阻; Supplier Part: C23345; Manufacturer: UNI-ROYAL(厚声); Supplier Footprint: 0603; JLCPCB Part Class: 基础库; Datasheet: https://atta.szlcsc.com/upload/public/pdf/source/20200306/C422600_1E6D84923E4A46A82E41ADD87F860B5C.pdf; Supplier: LCSC; Type: 厚膜电阻; Tolerance: ±1%; Power(Watts): 100mW; Overload Voltage (Max): 75V; Temperature Coefficient: ±100ppm/℃; Operating Temperature Range: -55℃~+155℃
R8 R14-R21 R37-R41 R77-R92 = 0402WGF220JTCE: 电阻类型:厚膜电阻;阻值:22Ω;精度:±1%;功率:62.5mW;最大工作电压:50V;温度系数:±100ppm/℃;; LCSC Part Name: 22Ω ±1% 62.5mW 厚膜电阻; Supplier Part: C25092; Manufacturer: UNI-ROYAL(厚声); Supplier Footprint: 0402; JLCPCB Part Class: 基础库; Datasheet: https://atta.szlcsc.com/upload/public/pdf/source/20200306/C422600_1E6D84923E4A46A82E41ADD87F860B5C.pdf; Supplier: LCSC; Type: 厚膜电阻; Tolerance: ±1%; Power(Watts): 62.5mW; Overload Voltage (Max): 50V; Temperature Coefficient: ±100ppm/℃; Operating Temperature Range: -55℃~+155℃
R9 R10 R13 R32 R35 R36 R43 R48 R49 R53 R54 R69-R72 R76 R93-R99 = 0402WGF1002TCE: 电阻类型:厚膜电阻;阻值:10kΩ;精度:±1%;功率:62.5mW;最大工作电压:50V;温度系数:±100ppm/℃;; LCSC Part Name: 10kΩ ±1% 62.5mW 厚膜电阻; Supplier Part: C25744; Manufacturer: UNI-ROYAL(厚声); Supplier Footprint: 0402; JLCPCB Part Class: 基础库; Datasheet: https://atta.szlcsc.com/upload/public/pdf/source/20200306/C422600_1E6D84923E4A46A82E41ADD87F860B5C.pdf; Supplier: LCSC; Type: 厚膜电阻; Tolerance: ±1%; Power(Watts): 62.5mW; Overload Voltage (Max): 50V; Temperature Coefficient: ±100ppm/℃; Operating Temperature Range: -55℃~+155℃
R11 R12 R74 R75 = 0402WGF4701TCE: 电阻类型:厚膜电阻;阻值:4.7kΩ;精度:±1%;功率:62.5mW;最大工作电压:50V;温度系数:±100ppm/℃;; LCSC Part Name: 4.7kΩ ±1% 62.5mW 厚膜电阻; Supplier Part: C25900; Manufacturer: UNI-ROYAL(厚声); Supplier Footprint: 0402; JLCPCB Part Class: 基础库; Datasheet: https://atta.szlcsc.com/upload/public/pdf/source/20200306/C422600_1E6D84923E4A46A82E41ADD87F860B5C.pdf; Supplier: LCSC; Type: 厚膜电阻; Tolerance: ±1%; Power(Watts): 62.5mW; Overload Voltage (Max): 50V; Temperature Coefficient: ±100ppm/℃; Operating Temperature Range: -55℃~+155℃
R22-R31 = 0402WGF4700TCE: 电阻类型:厚膜电阻;阻值:470Ω;精度:±1%;功率:62.5mW;最大工作电压:50V;温度系数:±100ppm/℃;; LCSC Part Name: 470Ω ±1% 62.5mW 厚膜电阻; Supplier Part: C25117; Manufacturer: UNI-ROYAL(厚声); Supplier Footprint: 0402; JLCPCB Part Class: 基础库; Datasheet: https://atta.szlcsc.com/upload/public/pdf/source/20200306/C422600_1E6D84923E4A46A82E41ADD87F860B5C.pdf; Supplier: LCSC; Type: 厚膜电阻; Tolerance: ±1%; Power(Watts): 62.5mW; Overload Voltage (Max): 50V; Temperature Coefficient: ±100ppm/℃; Operating Temperature Range: -55℃~+155℃
R33 = 0402WGF1000TCE: 电阻类型:厚膜电阻;阻值:100Ω;精度:±1%;功率:62.5mW;最大工作电压:50V;温度系数:±200ppm/℃;; LCSC Part Name: 100Ω ±1% 62.5mW 厚膜电阻; Supplier Part: C25076; Manufacturer: UNI-ROYAL(厚声); Supplier Footprint: 0402; JLCPCB Part Class: 基础库; Datasheet: https://atta.szlcsc.com/upload/public/pdf/source/20200306/C422600_1E6D84923E4A46A82E41ADD87F860B5C.pdf; Supplier: LCSC; Type: 厚膜电阻; Tolerance: ±1%; Power(Watts): 62.5mW; Overload Voltage (Max): 50V; Temperature Coefficient: ±200ppm/℃; Operating Temperature Range: -55℃~+155℃
R34 R44 R52 R57 = 0402WGF1003TCE: 电阻类型:厚膜电阻;阻值:100kΩ;精度:±1%;功率:62.5mW;最大工作电压:50V;温度系数:±100ppm/℃;; LCSC Part Name: 100kΩ ±1% 62.5mW 厚膜电阻; Supplier Part: C25741; Manufacturer: UNI-ROYAL(厚声); Supplier Footprint: 0402; JLCPCB Part Class: 基础库; Datasheet: https://atta.szlcsc.com/upload/public/pdf/source/20200306/C422600_1E6D84923E4A46A82E41ADD87F860B5C.pdf; Supplier: LCSC; Type: 厚膜电阻; Tolerance: ±1%; Power(Watts): 62.5mW; Overload Voltage (Max): 50V; Temperature Coefficient: ±100ppm/℃; Operating Temperature Range: -55℃~+155℃
U1 = STM32H723VGT6: CPU内核:ARM-M系列;程序存储容量:1MB;RAM总容量:564KB;GPIO端口数量:80;工作电压范围:1.71V~3.6V;CPU最大主频:550MHz;程序存储器类型:FLASH;应用领域:-;; Supplier Part: C730142; Manufacturer: ST(意法半导体); Supplier Footprint: LQFP-100(14x14); JLCPCB Part Class: 扩展库; Datasheet: https://atta.szlcsc.com/upload/public/pdf/source/20200902/C730141_32325B298F902737689CA9A88D6BD2F2.pdf; Supplier: LCSC; CPU Core: ARM-M系列; Program Storage Size: 1MB; RAM Size: 564KB; GPIO Ports Number: 80; Operating Voltage Range: 1.71V~3.6V; CPU Maximum Speed: 550MHz; Program Memory Type: FLASH; Operating Temperature Range: -40℃~+85℃; ADC (Bit): 16bit; DAC (Bit): 12bit; Universal Serial Bus: 有; Peripheral/Function: DMA；LCD/LED驱动; Secure Digital Input and Output: 有; Internal Oscillator: 有
U2 = W25Q64JVXGIQ: Supplier Part: C2940195; Manufacturer: WINBOND(华邦); Supplier Footprint: XSON-8-EP(4x4); JLCPCB Part Class: 扩展库; Datasheet: https://atta.szlcsc.com/upload/public/pdf/source/20220111/96C134BA110DAC08742B3CB6C4519B4C.pdf; Supplier: LCSC
U3 = BMI088: 传感器类型:加速度计陀螺仪;; Supplier Part: C194919; Manufacturer: Bosch(博世); Supplier Footprint: LGA-16(3x4.5); JLCPCB Part Class: 扩展库; Datasheet: https://atta.szlcsc.com/upload/public/pdf/source/20180628/C194919_66CCF125FF968C218A4D358C68AC68D6.pdf; Supplier: LCSC; Sensor Type: 加速度计陀螺仪; Operating Temperature: -40℃~+85℃
USB1 = TYPE-C 16PIN 2MD(073): 连接器类型:Type-C;标准:-;公母:母;端口数量:1;触点数量:16P;安装方式:卧贴;额定电流 - 电源:5A;工作温度范围:-25℃~+85℃;; LCSC Part Name: Type-C 母 卧贴; Supplier Part: C2765186; Manufacturer: SHOU HAN(首韩); Supplier Footprint: SMD; JLCPCB Part Class: 扩展库; Datasheet: https://atta.szlcsc.com/upload/public/pdf/source/20211123/39B17C16241EAC15C5E277BDA434118E.pdf; Supplier: LCSC; Connector Type: Type-C; Gender: 母; Number of Ports: 1; Number of Contacts: 16P; Mounting Style: 卧贴; Current Rating - Power (Max): 5A; Operating Temperature Range: -25℃~+85℃
X1 = XL7EL89CKI-111YLC-24M: 晶振类型:贴片晶振;频率:24MHz;常温频差:±10ppm;外接负载电容:8pF;频率稳定度(全温):±20ppm;; LCSC Part Name: 24MHz ±10ppm 8pF; Supplier Part: C2965580; Manufacturer: YXC(扬兴晶振); Supplier Footprint: SMD2016-4P; JLCPCB Part Class: 扩展库; Datasheet: https://atta.szlcsc.com/upload/public/pdf/source/20240329/C26C9A15A73CBCFBF373B30A8E126750.pdf; Supplier: LCSC; Crystal Type: 贴片晶振; Normal temperature Frequency Tolerance: ±10ppm; External load capacitor: 8pF; Frequency Stability(Full temperature range): ±20ppm; Operating Temperature: -40℃~+85℃
C17 C22 C23 = GRM21BR61H106KE43L: 容值:10uF;精度:±10%;额定电压:50V;材质(温度系数):X5R;; LCSC Part Name: 10uF ±10% 50V; Supplier Part: C440198; Manufacturer: muRata(村田); Supplier Footprint: 0805; JLCPCB Part Class: 基础库; Datasheet: https://atta.szlcsc.com/upload/public/pdf/source/20230811/95AAE0C9AF55EDC31B7A4D8B733F534E.pdf; Supplier: LCSC; Tolerance: ±10%; Voltage Rated: 50V; Temperature Coefficient: X5R
C18 C19 C24 = CC0603KRX7R9BB104: 容值:100nF;精度:±10%;额定电压:50V;材质(温度系数):X7R;; LCSC Part Name: 100nF ±10% 50V; Supplier Part: C14663; Manufacturer: YAGEO(国巨); Supplier Footprint: 0603; JLCPCB Part Class: 基础库; Datasheet: https://atta.szlcsc.com/upload/public/pdf/source/20180910/C282072_33301C7F631E79921B82A8DAC6BCC5B3.pdf; Supplier: LCSC; Tolerance: ±10%; Voltage Rated: 50V; Temperature Coefficient: X7R
C20 = CL10A475KO8NNNC: 容值:4.7uF;精度:±10%;额定电压:16V;材质(温度系数):X5R;; LCSC Part Name: 4.7uF ±10% 16V; Supplier Part: C19666; Manufacturer: SAMSUNG(三星); Supplier Footprint: 0603; JLCPCB Part Class: 基础库; Datasheet: https://atta.szlcsc.com/upload/public/pdf/source/20160218/1457707763339.pdf; Supplier: LCSC; Tolerance: ±10%; Voltage Rated: 16V; Temperature Coefficient: X5R
C21 = CL10B333KB8NNNC: 容值:33nF;精度:±10%;额定电压:50V;材质(温度系数):X7R;; LCSC Part Name: 33nF ±10% 50V; Supplier Part: C21117; Manufacturer: SAMSUNG(三星); Supplier Footprint: 0603; JLCPCB Part Class: 基础库; Datasheet: https://atta.szlcsc.com/upload/public/pdf/source/20160218/1457707763339.pdf; Supplier: LCSC; Tolerance: ±10%; Voltage Rated: 50V; Temperature Coefficient: X7R
C27 = 0402CG330J500NT: 容值:33pF;精度:±5%;额定电压:50V;材质(温度系数):C0G;; LCSC Part Name: 33pF ±5% 50V; Supplier Part: C1562; Manufacturer: FH(风华); Supplier Footprint: 0402; JLCPCB Part Class: 基础库; Datasheet: https://atta.szlcsc.com/upload/public/pdf/source/20200305/C486355_26A10D38EF8C2A5C37091D0039909270.pdf; Supplier: LCSC; Tolerance: ±5%; Voltage Rated: 50V; Temperature Coefficient: C0G
C34 C36 = CL21B224KBFNNNE: 容值:220nF;精度:±10%;额定电压:50V;材质(温度系数):X7R;; LCSC Part Name: 220nF ±10% 50V; Supplier Part: C5378; Manufacturer: SAMSUNG(三星); Supplier Footprint: 0805; JLCPCB Part Class: 基础库; Datasheet: https://atta.szlcsc.com/upload/public/pdf/source/20160218/1457707763339.pdf; Supplier: LCSC; Tolerance: ±10%; Voltage Rated: 50V; Temperature Coefficient: X7R
CN5 = XT30PW-M: 类别:-;类型1:-;; LCSC Part Name: AMASS(艾迈斯)航模插头 卧式弯脚 XT30PW-M公头; Supplier Part: C431092; Manufacturer: AMASS(艾迈斯); JLCPCB Part Class: 扩展库; Datasheet: https://atta.szlcsc.com/upload/public/pdf/source/20220222/6A9F22F7850E25B33E1BE430ADF8560B.pdf; Supplier: LCSC; Brand: 艾迈斯; Type: 航模插头; RatedVoltage: DC 500V; InterfaceType: 公头; RatedCurrent: 15A; RecommendedWireGauge: 16/18/20AWG; contact resistance: 1.2mΩ; specifications: 2pin
CN7 CN8 = XT30U-M: 类别:-;类型1:-;; LCSC Part Name: AMASS(艾迈斯)轻量版锂电池插头公头 XT30U-M; Supplier Part: C99101; Manufacturer: AMASS(艾迈斯); JLCPCB Part Class: 扩展库; Datasheet: https://atta.szlcsc.com/upload/public/pdf/source/20170606/1496716542582.pdf; Supplier: LCSC; Brand: 艾迈斯; Type: 插头; Colour: 黄色; InterfaceType: 公头
D17 = SS34_C8678: 二极管配置:独立式;正向压降(Vf):550mV@3A;直流反向耐压(Vr):40V;平均整流电流(Io):3A;; LCSC Part Name: 电压:40V 电流:3A; Supplier Part: C8678; Manufacturer: MDD; Supplier Footprint: SMA(DO-214AC); JLCPCB Part Class: 基础库; Datasheet: https://atta.szlcsc.com/upload/public/pdf/source/20230314/A80AE34493C69B89E2F4B1712F433538.pdf; Supplier: LCSC; Diode Configuration: 独立式; Forward Voltage (Vf@If): 550mV@3A; Reverse Voltage (Vr): 40V; Average Rectified Current (Io): 3A; Reverse Leakage Current (Ir): 500uA@40V
D18 D19 = BZX584C9V1_C19077465: 二极管配置:独立式;稳压值(标称值):9.1V;稳压值(范围):8.5V~9.6V;功率(Pd):150mW;; Supplier Part: C19077465; Manufacturer: 宏迦橙; Supplier Footprint: SOD-523; JLCPCB Part Class: 扩展库; Datasheet: https://atta.szlcsc.com/upload/public/pdf/source/20240403/17C82979B7F938C6B80AC7FEE4722071.pdf; Supplier: LCSC; Diode Configuration: 独立式; Zener Voltage (Nom): 9.1V; Reverse Leakage Current (Ir): 500nA@6V; Zener Voltage (Range): 8.5V~9.6V; Power Dissipation: 150mW; Zener Impedance (Zzt): 15Ω
L1 L2 = FHD4020S-100MT: 电感值:10uH;精度:±20%;额定电流:2.35A;饱和电流(Isat):3.5A;; LCSC Part Name: 10uH ±20% 3.5A; Supplier Part: C602032; Manufacturer: cjiang(长江微电); Supplier Footprint: SMD,4x4mm; JLCPCB Part Class: 扩展库; Datasheet: https://atta.szlcsc.com/upload/public/pdf/source/20200609/C601990_BCEA243EC4DA0A9A288AA78A6DFB48A5.pdf; Supplier: LCSC; Tolerance: ±20%; Rated Current: 2.35A; Saturation Current (Isat): 3.5A; DC Resistance (DCR): 190mΩ
LED2-LED7 = KT-0603R: 发光颜色:红色;功率:-;正向电流:-;主波长:-;二极管配置:-;透镜颜色:-;色温:-;发光角度:-;载带方式:-;工作温度:-40℃~+85℃;; LCSC Part Name: 0603 红灯 高亮; Supplier Part: C2286; Manufacturer: KENTO; Supplier Footprint: 0603; JLCPCB Part Class: 基础库; Datasheet: https://atta.szlcsc.com/upload/public/pdf/source/20160616/1466072038404.pdf; Supplier: LCSC; Emitted Color: 红色; Operating Temperature: -40℃~+85℃
R42 = 0402WGF5102TCE: 电阻类型:厚膜电阻;阻值:51kΩ;精度:±1%;功率:62.5mW;最大工作电压:50V;温度系数:±100ppm/℃;; LCSC Part Name: 51kΩ ±1% 62.5mW 厚膜电阻; Supplier Part: C25794; Manufacturer: UNI-ROYAL(厚声); Supplier Footprint: 0402; JLCPCB Part Class: 基础库; Datasheet: https://atta.szlcsc.com/upload/public/pdf/source/20200306/C422600_1E6D84923E4A46A82E41ADD87F860B5C.pdf; Supplier: LCSC; Type: 厚膜电阻; Tolerance: ±1%; Power(Watts): 62.5mW; Overload Voltage (Max): 50V; Temperature Coefficient: ±100ppm/℃; Operating Temperature Range: -55℃~+155℃
R45 R46 = 0402WGF100JTCE: 电阻类型:厚膜电阻;阻值:10Ω;精度:±1%;功率:62.5mW;最大工作电压:50V;温度系数:±200ppm/℃;; LCSC Part Name: 10Ω ±1% 62.5mW 厚膜电阻; Supplier Part: C25077; Manufacturer: UNI-ROYAL(厚声); Supplier Footprint: 0402; JLCPCB Part Class: 基础库; Datasheet: https://atta.szlcsc.com/upload/public/pdf/source/20200306/C422600_1E6D84923E4A46A82E41ADD87F860B5C.pdf; Supplier: LCSC; Type: 厚膜电阻; Tolerance: ±1%; Power(Watts): 62.5mW; Overload Voltage (Max): 50V; Temperature Coefficient: ±200ppm/℃; Operating Temperature Range: -55℃~+155℃
R47 = 0603WAF3902T5E: 电阻类型:厚膜电阻;阻值:39kΩ;精度:±1%;功率:100mW;最大工作电压:75V;温度系数:±100ppm/℃;; LCSC Part Name: 39kΩ ±1% 100mW 厚膜电阻; Supplier Part: C23153; Manufacturer: UNI-ROYAL(厚声); Supplier Footprint: 0603; JLCPCB Part Class: 基础库; Datasheet: https://atta.szlcsc.com/upload/public/pdf/source/20200306/C422600_1E6D84923E4A46A82E41ADD87F860B5C.pdf; Supplier: LCSC; Type: 厚膜电阻; Tolerance: ±1%; Power(Watts): 100mW; Overload Voltage (Max): 75V; Temperature Coefficient: ±100ppm/℃; Operating Temperature Range: -55℃~+155℃
R50 R55 = 0402WGF1001TCE: 电阻类型:厚膜电阻;阻值:1kΩ;精度:±1%;功率:62.5mW;最大工作电压:50V;温度系数:±100ppm/℃;; LCSC Part Name: 1kΩ ±1% 62.5mW 厚膜电阻; Supplier Part: C11702; Manufacturer: UNI-ROYAL(厚声); Supplier Footprint: 0402; JLCPCB Part Class: 基础库; Datasheet: https://atta.szlcsc.com/upload/public/pdf/source/20200306/C422600_1E6D84923E4A46A82E41ADD87F860B5C.pdf; Supplier: LCSC; Type: 厚膜电阻; Tolerance: ±1%; Power(Watts): 62.5mW; Overload Voltage (Max): 50V; Temperature Coefficient: ±100ppm/℃; Operating Temperature Range: -55℃~+155℃
R51 R56 = RC0402FR-0710KL: 电阻类型:厚膜电阻;阻值:10kΩ;精度:±1%;功率:62.5mW;最大工作电压:50V;温度系数:±100ppm/℃;; LCSC Part Name: 厚膜电阻 10kΩ ±1% 62.5mW; Supplier Part: C60490; Manufacturer: YAGEO(国巨); Supplier Footprint: 0402; JLCPCB Part Class: 扩展库; Datasheet: https://atta.szlcsc.com/upload/public/pdf/source/20170925/C131467_1506321478108990263.pdf; Supplier: LCSC; Type: 厚膜电阻; Tolerance: ±1%; Power(Watts): 62.5mW; Overload Voltage (Max): 50V; Temperature Coefficient: ±100ppm/℃; Operating Temperature Range: -55℃~+155℃
U4 = TPS62932DRLR: 功能类型:降压型;输出类型:可调;输入电压:3.8V~30V;输出电压:800mV~22V;输出电流(最大值):2A;; Supplier Part: C3032935; Manufacturer: TI(德州仪器); Supplier Footprint: SOT-5x3-8; JLCPCB Part Class: 扩展库; Datasheet: https://www.ti.com/cn/lit/gpn/tps62933; Supplier: LCSC; Function: 降压型; Output Type: 可调; Input Voltage: 3.8V~30V; Output Voltage: 800mV~22V; Output Current (Max): 2A; Switching Frequency: 2.2MHz; Operating Temperature: -40℃~+150℃@(TJ); Synchronous Rectification: 是; Number of Outputs: 1; Topology: 降压式; Switch tube (built-in/external): 内置
U5 = BL9342: 功能类型:降压型;输入电压:-;输出电流(最大值):-;; Supplier Part: C93176; Manufacturer: BL(上海贝岭); Supplier Footprint: SOT-23-6; JLCPCB Part Class: 扩展库; Datasheet: https://atta.szlcsc.com/upload/public/pdf/source/20220914/8FD74402BCE4B7AF0FD3964135D49DC4.pdf; Supplier: LCSC; Function: 降压型; Switch tube (built-in/external): 内置
U6 = XC6206P332MR-G_C5446: 输出类型:固定;最大输入电压:6V;输出电压:3.3V;最大输出电流:200mA;电源纹波抑制比(PSRR):-;输出极性:正极;; LCSC Part Name: 输入6V 输出3.3V 200mA; Supplier Part: C5446; Manufacturer: TOREX(特瑞仕); Supplier Footprint: SOT-23-3L; JLCPCB Part Class: 基础库; Datasheet: https://atta.szlcsc.com/upload/public/pdf/source/20130823/1457706639850.pdf; Supplier: LCSC; Output Type: 固定; Maximum Input Voltage: 6V; Output Voltage: 3.3V; MAX Output Current: 200mA; Dropout Voltage: 680mV@(100mA); Output Polarity: 正极; Number of Outputs: 1
U9 U11 = S40N06D: 类型:1个N沟道;漏源电压(Vdss):60V;连续漏极电流(Id):40A;导通电阻(RDS(on)@Vgs,Id):12mΩ;阈值电压(Vgs(th)@Id):2.5V;; LCSC Part Name: 1个N沟道 耐压:60V 电流:40A; Supplier Part: C19271471; Manufacturer: HL(富海微); Supplier Footprint: PDFN(3x3); JLCPCB Part Class: 扩展库; Datasheet: https://atta.szlcsc.com/upload/public/pdf/source/20231127/A1E9899202489BDE4D68F715B990894D.pdf; Supplier: LCSC; Type: 1个N沟道; Drain Source Voltage (Vdss): 60V; Continuous Drain Current (Id): 40A; Drain Source On Resistance (RDS(on)@Vgs,Id): 12mΩ; Gate Threshold Voltage (Vgs(th)@Id): 2.5V
D20-D22 = PESD1CAN_C343993: 极性:双向;反向截止电压(Vrwm):24V;最大钳位电压:48V;峰值脉冲电流(Ipp)@10/1000us:6A;击穿电压:26.7V;; LCSC Part Name: 双向ESD; Supplier Part: C343993; Manufacturer: BORN(伯恩半导体); Supplier Footprint: SOT-23; JLCPCB Part Class: 扩展库; Datasheet: https://atta.szlcsc.com/upload/public/pdf/source/20181211/C343993_AF595724ADB82F42A1C256C97FD7AD6B.pdf; Supplier: LCSC; polarity: 双向; Reverse Stand-Off Voltage (Vrwm): 24V; Maximum Clamping Voltage: 48V; Peak Pulse Current (Ipp)@10/1000us: 6A; Breakdown Voltage: 26.7V; Type: ESD
D23-D28 = 1N5819WS_C191023: 正向压降(Vf):600mV@1A;直流反向耐压(Vr):40V;平均整流电流(Io):1A;; LCSC Part Name: 电压:40V 电流:1A; Supplier Part: C191023; Manufacturer: Hottech(合科泰); Supplier Footprint: SOD-323; JLCPCB Part Class: 基础库; Datasheet: https://atta.szlcsc.com/upload/public/pdf/source/20220428/3CB86FD8D28D653594B4E35F9D5AEFD9.pdf; Supplier: LCSC; Forward Voltage (Vf@If): 600mV@1A; Reverse Voltage (Vr): 40V; Average Rectified Current (Io): 1A
F1-F10 = JK-SMD0603-005: 最大电压:24V;最大电流:20A;保持电流:50mA;跳闸电流:150mA;; LCSC Part Name: 24V 50mA 0603自恢复; Supplier Part: C369141; Manufacturer: JK(金科); Supplier Footprint: 0603; JLCPCB Part Class: 扩展库; Datasheet: https://atta.szlcsc.com/upload/public/pdf/source/20190304/C369144_E5F18D284F95F1F6BA0EAAB26DB9054E.pdf; Supplier: LCSC; Operating Voltage (Max): 24V; Current Rating (Max): 20A; Hold Current: 50mA; Trip Current: 150mA; Maximum Time to Trip: 1s
L7-L9 = ACT45B-101-2P-TL003: 线路数:2;电感 @ 频率:100uH@100kHz;阻抗 @ 频率:5.8kΩ@10MHz;直流电阻(DCR):2Ω;; LCSC Part Name: 两路 1812共模滤波器 阻抗5.8kΩ@10MHz; Supplier Part: C88056; Manufacturer: TDK; Supplier Footprint: 1812; JLCPCB Part Class: 扩展库; Datasheet: https://atta.szlcsc.com/upload/public/pdf/source/20161123/1479873126504.pdf; Supplier: LCSC; Number of Lines: 2; Current Rating: 150mA; Inductance @ Frequency: 100uH@100kHz; Voltage Rating - DC: 50V; Impedance @ Frequency: 5.8kΩ@10MHz; DC Resistance (DCR): 2Ω; Operating Temperature: -40℃~+150℃
R58-R60 R68 R73 = 0402WGF1200TCE: 电阻类型:厚膜电阻;阻值:120Ω;精度:±1%;功率:62.5mW;最大工作电压:50V;温度系数:±100ppm/℃;; LCSC Part Name: 120Ω ±1% 62.5mW 厚膜电阻; Supplier Part: C25079; Manufacturer: UNI-ROYAL(厚声); Supplier Footprint: 0402; JLCPCB Part Class: 基础库; Datasheet: https://atta.szlcsc.com/upload/public/pdf/source/20200306/C422600_1E6D84923E4A46A82E41ADD87F860B5C.pdf; Supplier: LCSC; Type: 厚膜电阻; Tolerance: ±1%; Power(Watts): 62.5mW; Overload Voltage (Max): 50V; Temperature Coefficient: ±100ppm/℃; Operating Temperature Range: -55℃~+155℃
R61-R66 = 0603WAF220KT5E: 电阻类型:厚膜电阻;阻值:2.2Ω;精度:±1%;功率:100mW;最大工作电压:75V;温度系数:±400ppm/℃;; LCSC Part Name: 2.2Ω ±1% 100mW 厚膜电阻; Supplier Part: C22939; Manufacturer: UNI-ROYAL(厚声); Supplier Footprint: 0603; JLCPCB Part Class: 基础库; Datasheet: https://atta.szlcsc.com/upload/public/pdf/source/20200306/C422600_1E6D84923E4A46A82E41ADD87F860B5C.pdf; Supplier: LCSC; Type: 厚膜电阻; Tolerance: ±1%; Power(Watts): 100mW; Overload Voltage (Max): 75V; Temperature Coefficient: ±400ppm/℃; Operating Temperature Range: -55℃~+155℃
U13-U15 = TJA1057T/1Z: 类型:收发器;数据速率:5Mbps;; Supplier Part: C961484; Manufacturer: NXP(恩智浦); Supplier Footprint: SOP-8; JLCPCB Part Class: 扩展库; Datasheet: https://atta.szlcsc.com/upload/public/pdf/source/20191122/C459823_BE8028E39B5B6F0136568BF83B204F7A.pdf; Supplier: LCSC; Type: 收发器; Data Rate: 5Mbps; Supply Voltage: 4.75V~5.25V; Operating Temperature: -40℃~+150℃
U16-U18 U21 U22 = SM02B-GHS-TB(LF)(SN): 插针结构:1x2P;间距:1.25mm;安装方式:卧贴;参考系列:GH;总PIN数:2P;排数:1;每排PIN数:2;行距:-;额定电流:1A;触头材质:磷青铜;触头镀层:锡;工作温度范围:-25℃~+85℃;; LCSC Part Name: 1x2P 间距:1.25mm 卧贴 系列:GH; Supplier Part: C189893; Manufacturer: JST; Supplier Footprint: SMD,P=1.25mm,卧贴; JLCPCB Part Class: 扩展库; Datasheet: https://atta.szlcsc.com/upload/public/pdf/source/20180323/112205B2CF875947C9562BFC7B01FA26.pdf; Supplier: LCSC; Pins Structure: 1x2P; Pitch: 1.25mm; Mounting Style: 卧贴; Reference Series: GH; Number of Pins: 2P; Number of Rows: 1; Number of PINs Per Row: 2; Current Rating (Max): 1A; Contact Material: 磷青铜; Contact Plating: 锡; Operating Temperature Range: -25℃~+85℃
D29 D30 = PSM712: 极性:双向;反向截止电压(Vrwm):12V；7V;最大钳位电压:10V；26V;峰值脉冲电流(Ipp)@10/1000us:12A;峰值脉冲功率(Ppp)@10/1000us:400W;击穿电压:7.5V；13.3V;; Supplier Part: C293967; Manufacturer: DOWO(东沃); Supplier Footprint: SOT-23; JLCPCB Part Class: 扩展库; Datasheet: https://atta.szlcsc.com/upload/public/pdf/source/20230921/A44845F15FADBB25B1703FD4867345BA.pdf; Supplier: LCSC; polarity: 双向; Reverse Stand-Off Voltage (Vrwm): 12V；7V; Maximum Clamping Voltage: 10V；26V; Peak Pulse Current (Ipp)@10/1000us: 12A; Peak Pulse Power Dissipation (Ppp)@10/1000us: 400W; Breakdown Voltage: 7.5V；13.3V; Reverse Leakage Current (Ir): 1uA; Number of Lines: 双路; Operating Temperature: -55℃~+125℃; Type: ESD
FPC2 = FH34SRJ-10S-0.5SH(50): 锁定特性:-;触点类型:双侧触点/上下接;触点数量:10P;间距:0.5mm;安装类型:卧贴;工作温度范围:-55℃~+105℃;; LCSC Part Name: 间距:0.5mm P数:10P 双侧触点/上下接; Supplier Part: C324723; Manufacturer: HRS(广濑); Supplier Footprint: SMD,P=0.5mm,卧贴; JLCPCB Part Class: 扩展库; Datasheet: https://atta.szlcsc.com/upload/public/pdf/source/20181106/C324723_E9ABA921A4EFDEDBBEA4C66F64ADCB20.pdf; Supplier: LCSC; Contact Type: 双侧触点/上下接; Number of Contacts: 10P; Pitch: 0.5mm; Mounting Type: 卧贴; FFC, FCB Thickness: 0.3mm; Height Above Board: 1mm; Contact Material: 磷青铜; Contact Plating: 金; Operating Temperature Range: -55℃~+105℃
H3 = 2.54-1*3P针: 插针结构:1x3P;间距:2.54mm;行距:-;圆针/方针:方针;安装类型:直插;排数:单排;总PIN位数:3P;额定电流:3A;额定电压:-;配合针长度:-;塑高:-;端接针长度:-;触头材质:-;触头镀层:-;工作温度范围:-40℃~+105℃;颜色:黑色;; LCSC Part Name: 间距:2.54mm 1x3P 直插 方针; Supplier Part: C49257; Manufacturer: BOOMELE(博穆精密); Supplier Footprint: 插件,P=2.54mm; JLCPCB Part Class: 扩展库; Datasheet: https://atta.szlcsc.com/upload/public/pdf/source/20221018/3E9408392E35E6F57A28985E5F7BF5C9.pdf; Supplier: LCSC; Pin Structure: 1x3P; Pitch: 2.54mm; Circluar Pins/Square Pins: 方针; Mounting Type: 直插; Number of Rows: 单排; Number of Pins: 3P; Current Rating (Max): 3A; Operating Temperature Range: -40℃~+105℃; Color: 黑色
SW1 SW2 = SKRTLAE010: 电路结构:单刀单掷;按钮形状:圆形按钮;安装方式:卧贴;开关长度:4.5mm;开关宽度:3.4mm;开关高度:3.3mm;触点电流:50mA;额定电压(DC):12V;带灯:-;机械寿命:-;; LCSC Part Name: 4.5*3.4*3.3mm 卧贴 轻触开关; Supplier Part: C110293; Manufacturer: ALPSALPINE(阿尔卑斯阿尔派); Supplier Footprint: SMD; JLCPCB Part Class: 扩展库; Datasheet: https://atta.szlcsc.com/upload/public/pdf/source/20170428/1493376812809.pdf; Supplier: LCSC; Circuit: 单刀单掷; Actuator Style: 圆形按钮; Mounting Style: 卧贴; Switch Length: 4.5mm; Switch Width: 3.4mm; Switch Height: 3.3mm; Contact Current: 50mA; Voltage Rating (DC): 12V
U19 U20 = SP3485EN-L/TR: 类型:收发器;数据速率:10Mbps;驱动器/接收器:1/1;; LCSC Part Name: 3.3V供电 10Mbps 收发器; Supplier Part: C8963; Manufacturer: MaxLinear(迈凌); Supplier Footprint: SOIC-8; JLCPCB Part Class: 基础库; Datasheet: https://atta.szlcsc.com/upload/public/pdf/source/20170601/1496285796963.pdf; Supplier: LCSC; Types: 收发器; Supply Voltage: 3.3V; Data Rate: 10Mbps; Driver/receiver: 1/1; Operating Temperature: -40℃~+85℃
CN6 = 24R-JMCS-G-B-TF(NSA): PIN总数:24P;间距:0.5mm;公母:母;安装方式:立贴;行数:2;额定电流:500mA;工作温度范围:-25℃~+85℃;; LCSC Part Name: 间距:0.5mm PIN:24P 母 立贴; Supplier Part: C2913014; Manufacturer: JST; Supplier Footprint: SMD,P=0.5mm; JLCPCB Part Class: 扩展库; Datasheet: https://atta.szlcsc.com/upload/public/pdf/source/20211207/DFFD0731965217034B3E63634073DB32.pdf; Supplier: LCSC; Number of Pins: 24P; Pitch: 0.5mm; Gender: 母; Mounting Style: 立贴; Number of Rows: 2; Current Rating (Max): 500mA; Operating Temperature Range: -25℃~+85℃
FPC1 = HC-FPC-05-09-24RLTAG: 锁定特性:翻盖式;触点类型:双侧触点/上下接;触点数量:24P;间距:0.5mm;安装类型:卧贴;工作温度范围:-55℃~+85℃;; LCSC Part Name: 翻盖式 双侧触点/上下接 P数:24P 间距:0.5mm; Supplier Part: C5213757; Manufacturer: HCTL(华灿天禄); Supplier Footprint: SMD,P=0.5mm,卧贴; JLCPCB Part Class: 扩展库; Datasheet: https://atta.szlcsc.com/upload/public/pdf/source/20221026/52A26161A88FCE07A06989F8D4399614.pdf; Supplier: LCSC; Locking Feature: 翻盖式; Contact Type: 双侧触点/上下接; Number of Contacts: 24P; Pitch: 0.5mm; Mounting Type: 卧贴; FFC, FCB Thickness: 0.3mm; Height Above Board: 1mm; Contact Material: 铜合金; Operating Temperature Range: -55℃~+85℃
U25 = ME6211C15M5G-N: 输出类型:固定;最大输入电压:6V;输出电压:1.5V;最大输出电流:300mA;电源纹波抑制比(PSRR):70dB@(1kHz);输出极性:正极;; LCSC Part Name: 输入6V 输出1.5V 300mA; Supplier Part: C53100; Manufacturer: MICRONE(南京微盟); Supplier Footprint: SOT-23-5; JLCPCB Part Class: 扩展库; Datasheet: https://atta.szlcsc.com/upload/public/pdf/source/20151012/1457707445394.pdf; Supplier: LCSC; Output Type: 固定; Maximum Input Voltage: 6V; Output Voltage: 1.5V; MAX Output Current: 300mA; Power Supply Rejection Ratio (PSRR): 70dB@(1kHz); Output Polarity: 正极; Number of Outputs: 1
U26 = ME6211C28M5G-N: 输出类型:固定;最大输入电压:6V;输出电压:2.8V;最大输出电流:450mA;电源纹波抑制比(PSRR):70dB@(1kHz);输出极性:正极;; LCSC Part Name: 输入6V 输出2.8V 450mA; Supplier Part: C53099; Manufacturer: MICRONE(南京微盟); Supplier Footprint: SOT-23-5; JLCPCB Part Class: 扩展库; Datasheet: https://atta.szlcsc.com/upload/public/pdf/source/20171014/C53099_15079757529561038531.pdf; Supplier: LCSC; Output Type: 固定; Maximum Input Voltage: 6V; Output Voltage: 2.8V; MAX Output Current: 450mA; Power Supply Rejection Ratio (PSRR): 70dB@(1kHz); Dropout Voltage: 220mV@(200mA); Output Polarity: 正极; Number of Outputs: 1
U27 = SD103AW_C5345965: 二极管配置:独立式;正向压降(Vf):600mV@200mA;直流反向耐压(Vr):40V;平均整流电流(Io):350mA;; LCSC Part Name: 电压:40V 电流:350mA S4; Supplier Part: C5345965; Manufacturer: HXY MOSFET(华轩阳电子); Supplier Footprint: SOD-123; JLCPCB Part Class: 扩展库; Datasheet: https://atta.szlcsc.com/upload/public/pdf/source/20230718/C15AB3BEAEB1A66CBDFF5A426E492919.pdf; Supplier: LCSC; Diode Configuration: 独立式; Forward Voltage (Vf@If): 600mV@200mA; Reverse Voltage (Vr): 40V; Average Rectified Current (Io): 350mA; Reverse Leakage Current (Ir): 5uA@30V; Peak forward surge current: 2A

## Nets
+1.5V: C41.2 FPC1.10 U25.5(VOUT)
+2.8V: C40.2 FPC1.1 FPC1.4 FPC1.11 FPC1.24 R95.2 U26.5(VOUT)
+5V: C20.2 CN2.1 CN3.1 CN4.1 CN6.4 CN6.6 D3.1(K) L1.2 LED1.3(VDD) R42.2 R97.1
+5VS: C27.2 C28.2 C29.2 C30.2 FPC2.1 H3.2 L2.2 R47.2 R96.1 U6.3(Vin) U13.3(VCC) U14.3(VCC) U15.3(VCC)
GND: C1.1 C2.2 C3.2 C4.1 C5.1 C6.1 C7.1 C8.1 C9.1 C10.1 C11.1 C12.1 C13.1 C14.2 C15.1 C16.1 C17.1 C18.1 C20.1 C21.2 C22.1 C23.1 C24.1 C26.1 C27.1 C28.1 C29.1 C30.1 C31.1 C32.1 C33.1 C35.1 C37.1 C38.2 C39.2 C40.1 C41.1 C42.1 C43.1 CN1.4 CN1.5 CN1.6 CN2.2 CN2.5 CN2.6 CN3.2 CN3.5 CN3.6 CN4.2 CN4.5 CN4.6 CN5.1 CN5.3 CN5.4 CN6.1 CN6.3 CN6.5 CN6.7 CN7.2 CN8.2 D2.1 D4.1 D5.1 D6.1 D7.1 D8.1 D9.1 D10.1 D11.1 D13.1 D14.1 D15.1 D16.1 D17.2(A) D20.3(A) D21.3(A) D22.3(A) D23.2(A) D24.2(A) D25.2(A) D26.2(A) D27.2(A) D28.2(A) D29.3 D30.3 D31.1 D32.1 D33.1 D34.1 D35.1 D36.1 D37.1 D38.1 D39.1 D40.1 D41.1 D42.1 D43.1 D44.1 D45.1 D46.1 FPC1.2 FPC1.15 FPC1.23 FPC1.25 FPC1.26 FPC2.10 FPC2.11 FPC2.12 H3.3 LED1.1(GND) LED2.1(K) LED3.1(K) LED4.1(K) LED5.1(K) LED6.1(K) LED7.1(K) Q1.2(S) Q2.2(E) Q3.2(E) Q4.2(E) Q5.2(E) R9.2 R11.1 R12.1 R32.1 R35.1 R36.1 R43.1 R47.1 R51.1 R56.1 R71.1 R72.1 SW1.1 SW1.3 SW1.4 SW1.5 SW2.1 SW2.3 SW2.4 SW2.5 U1.10(VSS) U1.19(VSSA) U1.26(VSS) U1.49(VSS) U1.74(VSS) U1.99(VSS) U2.4(GND) U2.9(EP) U3.2(NC) U3.4(GNDA) U3.6(GNDIO) U3.7(PS) U4.4(GND) U5.2(GND) U6.1(GND) U13.2(GND) U13.5(NC) U13.8(S) U14.2(GND) U14.5(NC) U14.8(S) U15.2(GND) U15.5(NC) U15.8(S) U16.3 U16.4 U17.3 U17.4 U18.3 U18.4 U19.5(GND) U20.5(GND) U21.3 U21.4 U22.3 U22.4 U25.2(VSS) U25.4(NC) U26.2(VSS) U26.4(NC) USB1.1(GND) USB1.12(GND) USB1.13(SHELL) USB1.14(SHELL) X1.2(GND) X1.4(GND)
VCC: BUZZER1.1(+) C6.2 C7.2 C8.2 C9.2 C10.2 C11.2 C12.2 C13.2 C14.1 C16.2 C31.2 C32.2 C33.2 C38.1 C39.1 C42.2 C43.2 CN1.1 CN6.8 D12.1(C) R8.2 R10.2 R13.1 R69.2 R70.2 R75.2 R76.2 R93.2 R94.2 R99.1 U1.6(VBAT) U1.11(VDD) U1.20(VREF+) U1.21(VDDA) U1.27(VDD) U1.50(VDD) U1.75(VDD) U1.100(VDD) U2.8(VCC) U3.3(VDD) U3.11(VDDIO) U6.2(Vout) U19.8(VCC) U20.8(VCC) U25.1(VIN) U25.3(CE) U26.1(VIN) U26.3(CE)
VCC_IN: C17.2 C18.2 C22.2 C23.2 C24.2 C34.2 C36.2 CN5.2 CN6.2 D18.2(K) D19.2(K) R22.2 R23.2 R24.2 R25.2 R26.2 R27.2 R28.2 R29.2 R30.2 R31.2 R34.2 R44.1 R48.2 R53.2 R98.1 U4.3(VIN) U5.5(VIN) U9.5(D) U11.5(D)
VCC_OUTPUT1: CN7.1 U9.1(S) U9.2(S) U9.3(S)
VCC_OUTPUT2: CN8.1 U11.1(S) U11.2(S) U11.3(S)
485_A1: CN6.16 D29.1 F8.2 U21.1
485_A2: CN6.20 D30.1 F10.2 U22.1
485_B1: CN6.14 D29.2 F7.2 U21.2
485_B2: CN6.18 D30.2 F9.2 U22.2
ADC1_CH18_KEY(PA05): R84.1 U1.29(PA5)
ADC_CH4_VBAT(PC04): C15.2 R34.1 R35.2 U1.32(PC4)
BOOT: H1.2 R9.1 U1.94(BOOT0)
CAN1_H: D20.1(K) D23.1(K) F1.2 U16.2
CAN1_L: D20.2(K) D24.1(K) F2.2 U16.1
CAN1_RX(PD00): U1.81(PD0) U14.4(RXD)
CAN1_TX(PD01): U1.82(PD1) U14.1(TXD)
CAN2_H: D21.1(K) D25.1(K) F3.2 U17.2
CAN2_L: D21.2(K) D26.1(K) F4.2 U17.1
CAN2_RX(PB05): U1.91(PB5) U13.4(RXD)
CAN2_TX(PB06): U1.92(PB6) U13.1(TXD)
CAN3_H: CN6.10 D22.1(K) D27.1(K) F5.2 U18.2
CAN3_L: CN6.12 D22.2(K) D28.1(K) F6.2 U18.1
CAN3_RX(PD12): U1.59(PD12) U15.4(RXD)
CAN3_TX(PD13): U1.60(PD13) U15.1(TXD)
DCMI_D0(PC06): FPC1.19 U1.63(PC6)
DCMI_D1(PC07): FPC1.21 U1.64(PC7)
DCMI_D2(PC08): FPC1.22 U1.65(PC8)
DCMI_D3(PC09): FPC1.20 U1.66(PC9)
DCMI_D4(PE04): FPC1.18 U1.3(PE4)
DCMI_D5(PD03): FPC1.16 U1.84(PD3)
DCMI_D6(PE05): FPC1.14 U1.4(PE5)
DCMI_D7(PE06): FPC1.12
DCMI_HSYNC(PA04): FPC1.9 U1.28(PA4)
DCMI_PIXCLK(PA06): FPC1.17 U1.30(PA6)
DCMI_PWDN(PC05): FPC1.8 U1.33(PC5)
DCMI_REST(PB12): U1.51(PB12) U27.1(C)
DCMI_SCL(PB08): CN6.22 FPC1.5 R93.1 U1.95(PB8)
DCMI_SDA(PB09): CN6.24 FPC1.3 R94.1 U1.96(PB9)
DCMI_VSYNC(PB07): FPC1.7 U1.93(PB7)
FB: R42.1 R43.2 U4.8(FB)
IIC2_SCL(PB10): R81.1 U1.46(PB10)
IIC2_SDA(PB11): R82.1 U1.47(PB11)
MCO1(PA8)(24MHZ): FPC1.13 U1.67(PA8)
MCU_RST: C5.2 R10.1 SW2.2 U1.14(NRST)
OCTOSPIM_P1_CLK(PB02): U1.36(PB2) U2.6(CLK)
OCTOSPIM_P1_D0(PD11): U1.58(PD11) U2.5(DI(IO0))
OCTOSPIM_P1_D1(PB00): U1.34(PB0) U2.2(DO(IO1))
OCTOSPIM_PI_D2(PA03): U1.25(PA3) U2.3(IO2)
OCTOSPIM_PI_D3(PA01): U1.23(PA1) U2.7(IO3)
OCTOSPIM_PI_NCS(PE11): R13.2 U1.41(PE11) U2.1(CS#)
OSC_IN: C4.2 U1.12(PH0-OSC_IN) X1.3
OSC_OUT: C3.1 U1.13(PH1-OSC_OUT) X1.1
PD10: R83.1 U1.57(PD10)
PE10: U1.40(PE10) U3.16(INT1)
PE12: U1.43(PE13) U3.12(INT3)
PE14: R87.1 U1.44(PE14)
PIS3_CLK(PC10): R92.1 U1.78(PC10)
POWER_OUT1: C35.2 R50.2 U1.8(PC14-OSC32_IN)
POWER_OUT2: C37.2 R55.2 U1.7(PC13)
SPI1_CS(PE15): R77.1 U1.45(PE15)
SPI1_MISO(PB04): R79.1 U1.90(PB4)
SPI1_MOSI(PD07): R80.1 U1.88(PD7)
SPI1_SCK(PB03): R78.1 U1.89(PB3)
SPI2_CS0(PC00): U1.15(PC0) U3.14(CSB1)
SPI2_CS1(PC03): U1.18(PC3_C) U3.5(CSB2)
SPI2_MISO(PC02): U1.17(PC2_C) U3.10(SDO2) U3.15(SDO1)
SPI2_MOSI(PC01): U1.16(PC1) U3.9(SDA/SDI)
SPI2_SCK(PB13): U1.52(PB13) U3.8(SCL/SCK)
SPI3_MISO(PC11): R91.1 U1.79(PC11)
SPI3_MOSI(PC12): R90.1 U1.80(PC12)
SPI6_MOSI(PA07): LED1.2(DI) U1.31(PA7)
SWCLK: R14.1 U1.76(PA14)
SWDIO: R15.1 U1.72(PA13)
TIM1_CH1(PE09): R40.2 U1.39(PE9)
TIM1_CH3(PE13): R41.2 U1.42(PE12)
TIM2_CH1(PA00): R38.2 U1.22(PA0)
TIM2_CH3(PA02): R39.2 U1.24(PA2)
TIM3_CH4(PB01): R33.1 U1.35(PB1)
TIM12_CH2(PB15): R37.1 U1.54(PB15)
UART5_RX(PD02): Q5.3(C) R75.1 U1.83(PD2)
UART7_RX(PE07): R16.1 U1.37(PE7)
UART7_TX(PE08): R17.1 U1.38(PE8)
UART8_RX(PE00): R88.1 U1.97(PE0)
UART8_TX(PE01): R89.1 U1.98(PE1)
UART9_RX(PD14): R86.1 U1.61(PD14)
UART9_TX(PD15): R85.1 U1.62(PD15)
UART10_RX(PE02): R18.1 U1.1(PE2)
UART10_TX(PE03): R19.1 U1.2(PE3)
USART1_RX(PA10): R21.1 U1.69(PA10)
USART1_TX(PA09): R20.1 U1.68(PA9)
USART2_DE(PD04): R72.2 U1.85(PD4) U20.2(RE#) U20.3(DE)
USART2_RX(PD06): R69.1 U1.87(PD6) U20.1(RO)
USART2_TX(PD05): U1.86(PD5) U20.4(DI)
USART3_DE(PB14): R71.2 U1.53(PB14) U19.2(RE#) U19.3(DE)
USART3_RX(PD09): R70.1 U1.56(PD9) U19.1(RO)
USART3_TX(PD08): U1.55(PD8) U19.4(DI)
USB_DM: D2.3 R1.2 USB1.5(DN2) USB1.7(DN1)
USB_DP: D2.2 R2.2 USB1.6(DP1) USB1.8(DP2)
USB_VBUS: D2.4 D3.2(A) USB1.2(VBUS) USB1.11(VBUS)
USER_KEY(PA15): R76.1 SW1.2 U1.77(PA15)
$1N788: R1.1 U1.70(PA11)
$1N1228: R12.2 USB1.10(CC2)
$1N1231: R11.2 USB1.4(CC1)
$1N1932: C1.2 U1.48(VCAP)
$1N2002: C2.1 U1.73(VCAP)
$1N2431: H1.1 R8.1
$1N3470: R2.1 U1.71(PA12)
$1N5240: CN1.3 D4.2 R15.2
$1N5247: CN1.2 D5.2 R14.2
$1N6177: CN2.3 D6.2 R16.2
$1N6216: CN2.4 D7.2 R17.2
$1N6255: CN3.3 D8.2 R18.2
$1N6294: CN3.4 D9.2 R19.2
$1N6370: CN4.4 D11.2 R21.2
$1N6409: CN4.3 D10.2 R20.2
$1N8894: Q1.1(G) R32.2 R33.2
$1N8904: Q1.3(D) R22.1 R23.1 R24.1 R25.1 R26.1 R27.1 R28.1 R29.1 R30.1 R31.1
$1N9624: BUZZER1.2(-) D12.2(A) Q2.3(C)
$1N9801: Q2.1(B) R36.2 R37.2
$1N12163: D16.2 H2.4 R38.1
$1N12202: D15.2 H2.3 R39.1
$1N12241: D14.2 H2.2 R40.1
$1N12280: D13.2 H2.1 R41.1
$2N672: C19.1 U4.6(BST)
$2N676: C19.2 L1.1 U4.5(SW)
$2N851: C21.1 U4.7(SS)
$2N1199: R44.2 U5.4(EN)
$2N1321: R45.1 U5.1(BST)
$2N1394: C25.1 R45.2
$2N1506: C25.2 D17.1(K) L2.1 R46.2 U5.6(SW)
$2N1628: C26.2 R46.1
$2N2825: Q3.3(C) R49.1
$2N2906: Q3.1(B) R50.1 R51.2
$2N3293: C34.1 D18.1(A) R48.1 R49.2 R52.2 U9.4(G)
$2N3476: LED2.2(A) R52.1
$2N4049: Q4.3(C) R54.1
$2N4051: Q4.1(B) R55.1 R56.2
$2N4063: C36.1 D19.1(A) R53.1 R54.2 R57.2 U11.4(G)
$2N4088: LED3.2(A) R57.1
$3N2644: L7.3 R58.2 R61.1 U14.7(CANH)
$3N2661: F1.1 L7.2 R61.2
$3N2670: L7.4 R58.1 R62.1 U14.6(CANL)
$3N2687: F2.1 L7.1 R62.2
$3N2696: L8.3 R59.2 R63.1 U13.7(CANH)
$3N2713: F3.1 L8.2 R63.2
$3N2722: L8.4 R59.1 R64.1 U13.6(CANL)
$3N2737: F4.1 L8.1 R64.2
$3N5638: L9.4 R60.1 R66.1 U15.6(CANL)
$3N5658: F6.1 L9.1 R66.2
$3N5675: F5.1 L9.2 R65.2
$3N5682: L9.3 R60.2 R65.1 U15.7(CANH)
$4N1182: F9.1 R73.2 U20.7(B)
$4N1191: F10.1 R73.1 U20.6(A)
$4N1200: F7.1 R68.2 U19.7(B)
$4N1209: F8.1 R68.1 U19.6(A)
$4N1963: H3.1 R74.1
$4N2044: Q5.1(B) R74.2
$5N5796: LED4.2(A) R99.2
$5N5839: LED5.2(A) R98.2
$5N5882: LED6.2(A) R97.2
$5N5925: LED7.2(A) R96.2
Net-(CN6-9): CN6.9 D39.2 R85.2
Net-(CN6-11): CN6.11 D40.2 R86.2
Net-(CN6-13): CN6.13 D41.2 R87.2
Net-(CN6-15): CN6.15 D42.2 R88.2
Net-(CN6-17): CN6.17 D43.2 R89.2
Net-(CN6-19): CN6.19 D44.2 R90.2
Net-(CN6-21): CN6.21 D45.2 R91.2
Net-(CN6-23): CN6.23 D46.2 R92.2
Net-(D31-2): D31.2 FPC2.9 R84.2
Net-(D32-2): D32.2 FPC2.8 R83.2
Net-(D33-2): D33.2 FPC2.7 R82.2
Net-(D34-2): D34.2 FPC2.6 R81.2
Net-(D35-2): D35.2 FPC2.5 R80.2
Net-(D36-2): D36.2 FPC2.4 R79.2
Net-(D37-2): D37.2 FPC2.3 R78.2
Net-(D38-2): D38.2 FPC2.2 R77.2
Net-(FPC1-6): FPC1.6 R95.1 U27.2(A)

Not connected (* = marked no-connect by the designer): BUZZER1 3(NC); LED1 4(DO); U1 5(PE6) 9(PC15-OSC32_OUT); U3 1(INT2)* 13(INT4)*; U4 1(RT) 2(EN); U5 3(FB); USB1 3(SBU2)* 9(SBU1)*

## Notes on the sheets
sheet 1
- mcu滤波
- 复位
- BMI088
- USB烧录
- 24M晶振
- 更换烧录方式
- BMI088加热
- SWD调试接口
- 指示灯
- MCU
- 输入电压采集
- 蜂鸣器
- 四路pwm
- QSPI Flash
- 串口
sheet 2
- 对外5V
- 对内5V
- 转3v3
- 可控两路输出
